# EasyEDA Pro project ProPrj_BEI Kimco Magnetic Cylindrical Frameless Linear Voice Coil Actuator LA15-16-020A_2025-06-26.epro, board PCB1
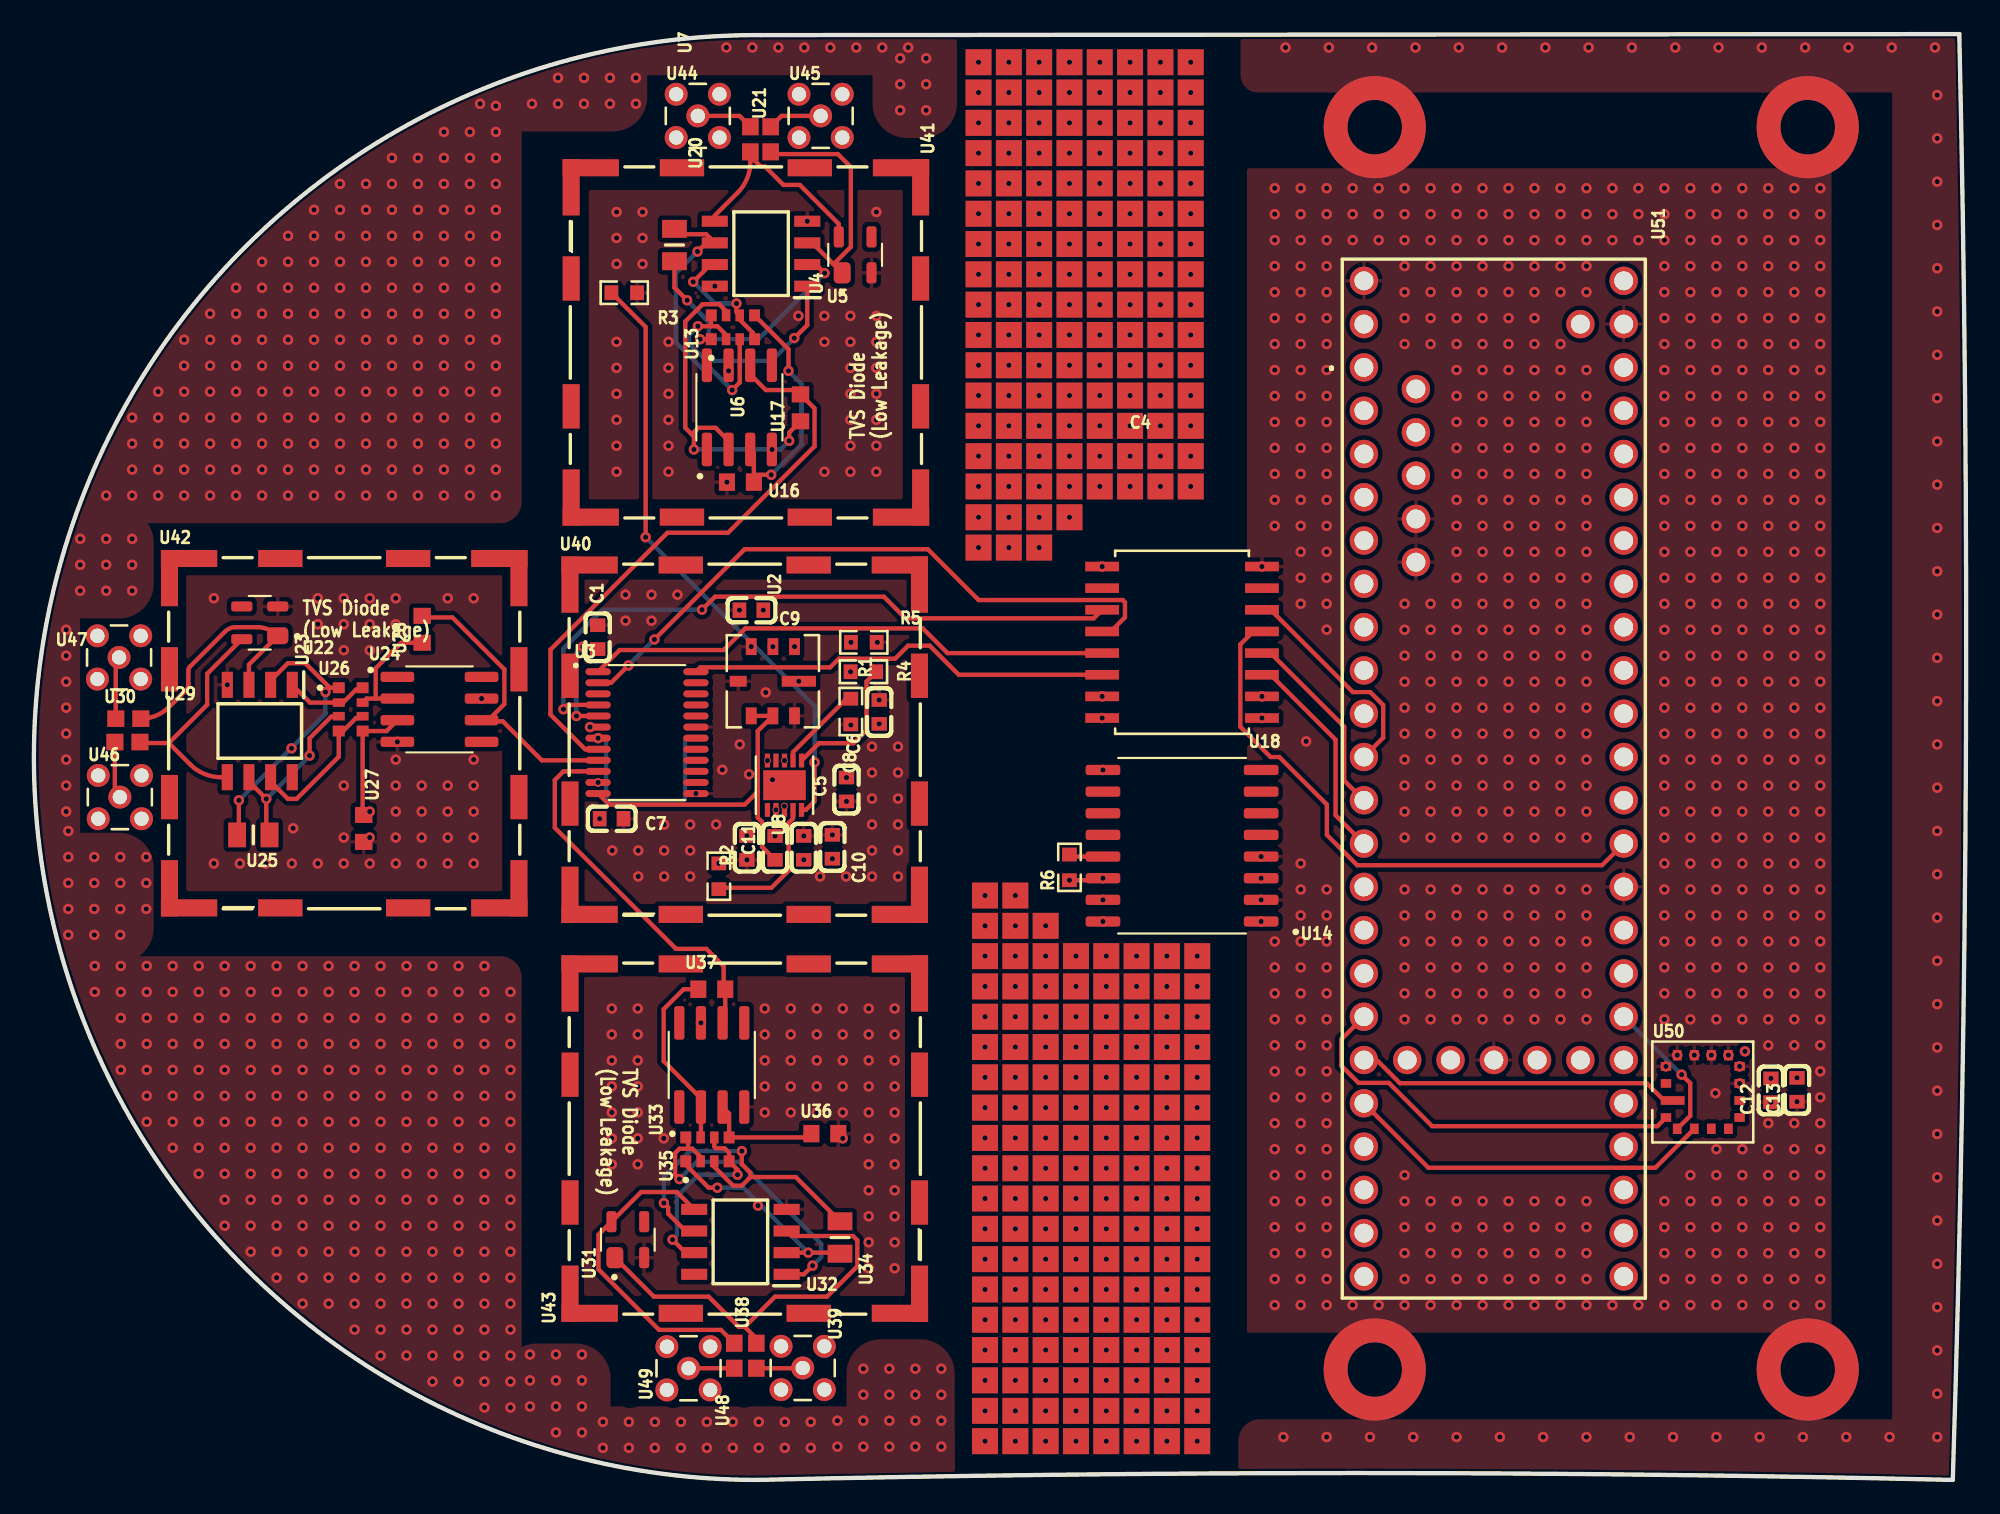
[diagram p1: board, top side]
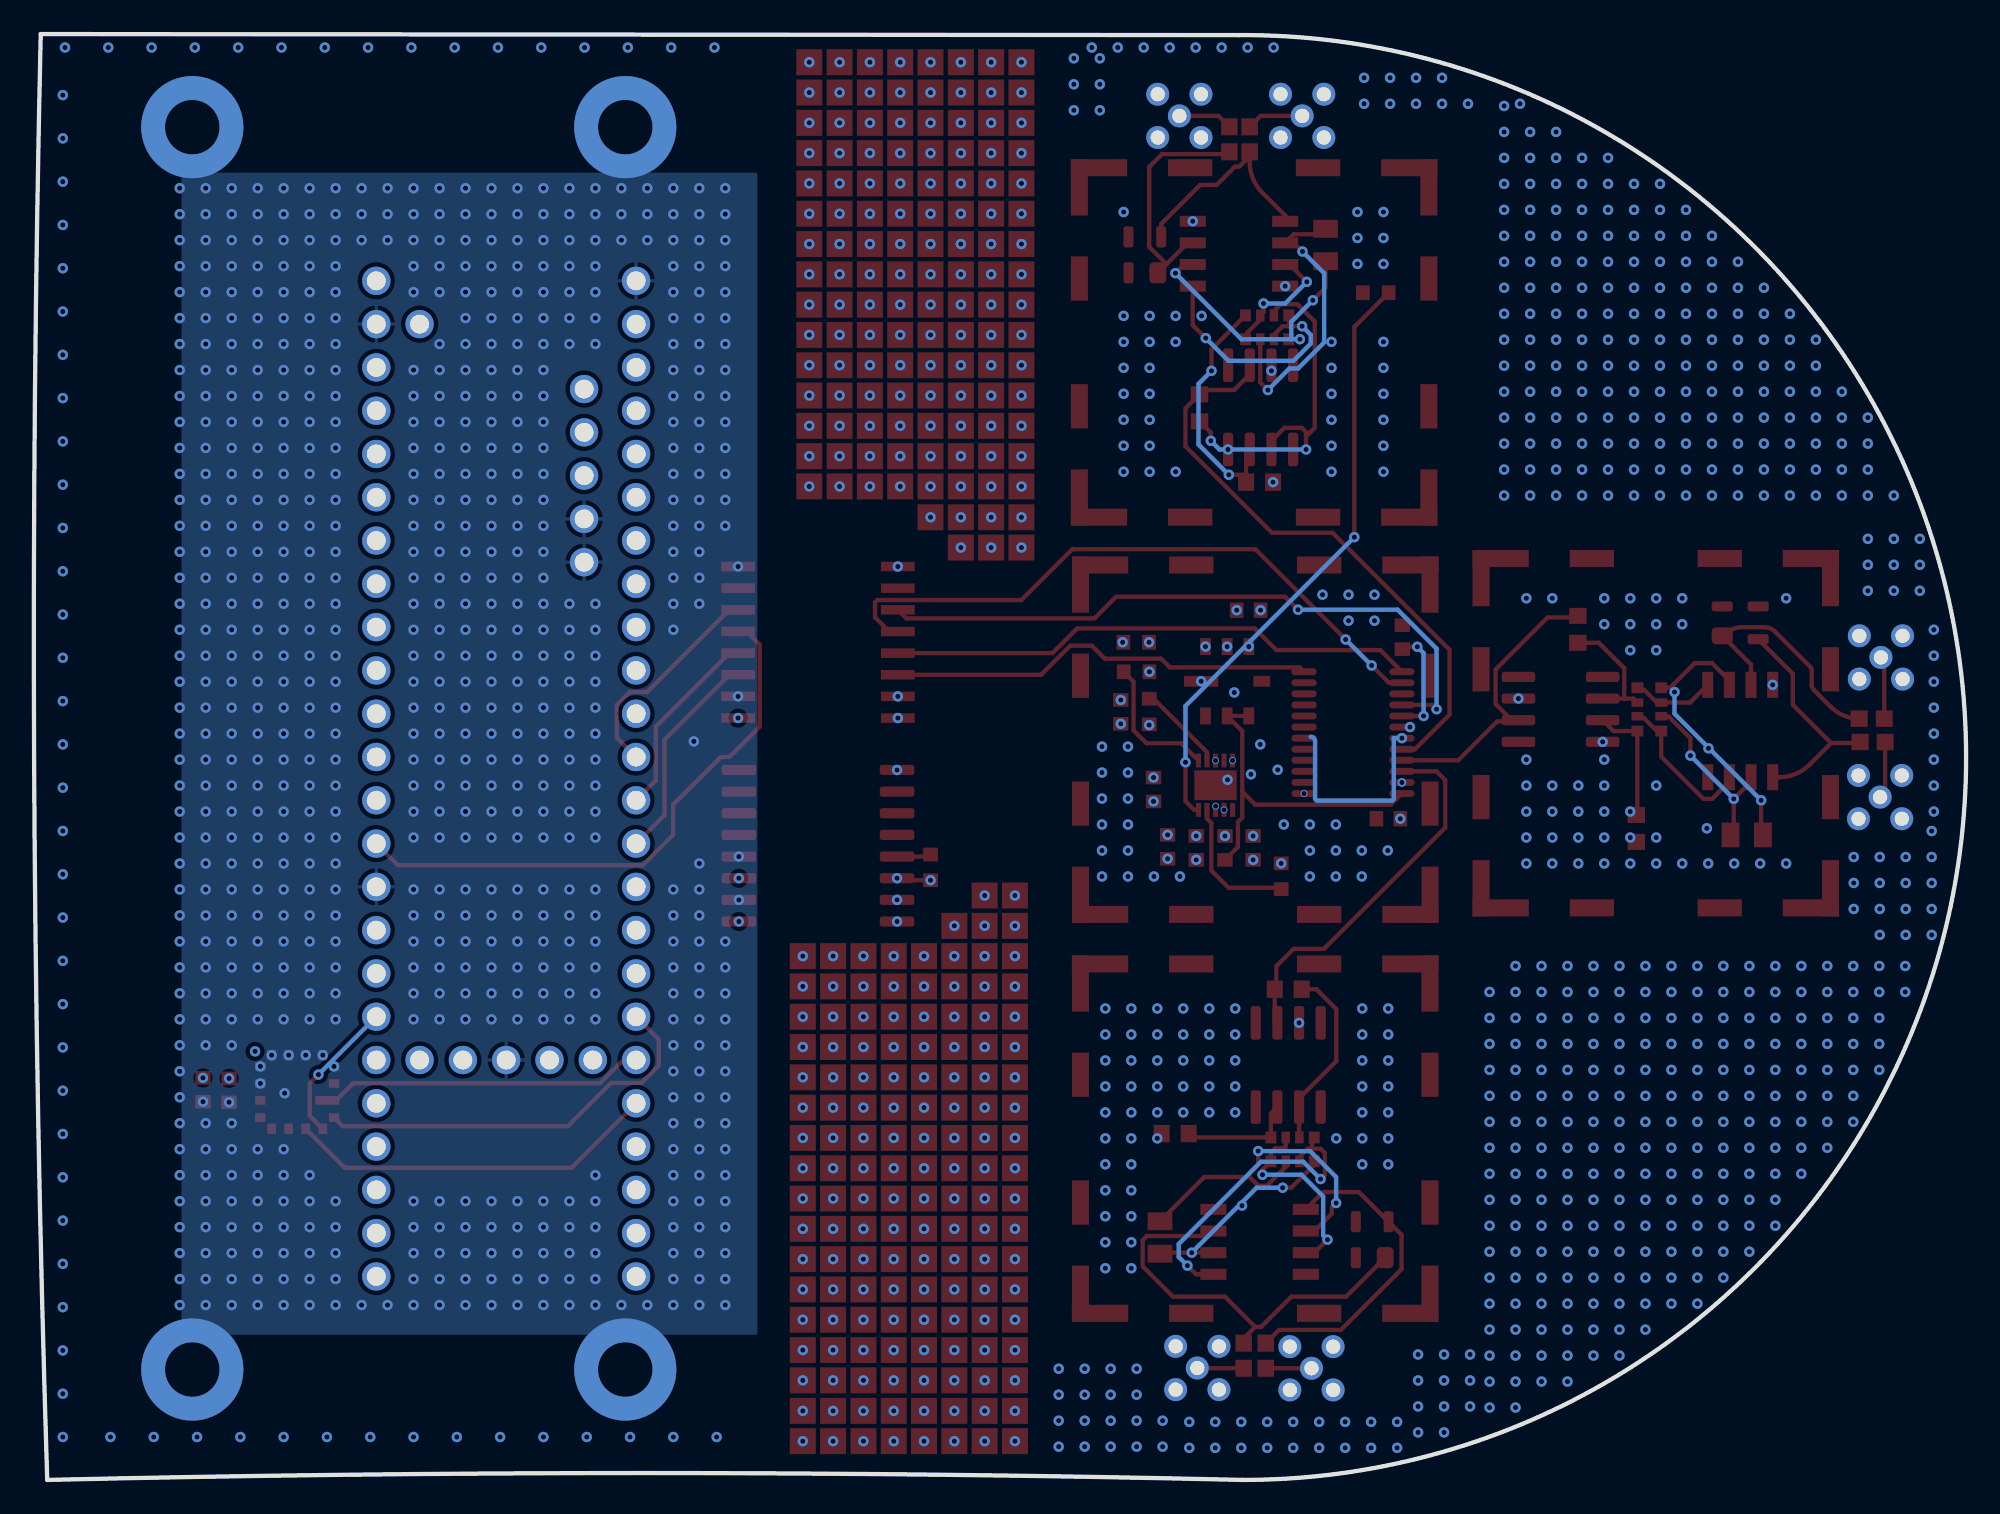
[diagram p2: board, bottom side, seen from below]

Outline 113.32 x 84.84 mm; copper layers: Top Layer, Inner1, Inner2, Bottom Layer. Coordinates in mm from the lower left corner of the outline.
Outline path: 42.45,0 arc(0,42.49) 42.64,84.78 112.93,84.84 arc(113.32,42.42) 112.55,0 arc(77.5,0.4) 42.45,0
Stack: Top Layer 0.035mm Outer layer thickness 1oz / Dielectric1 0.2104mm 7628 RC49% 8.6mil / Inner1 0.0152mm Inner layer thickness / Dielectric2 1.065mm 1.1mm H/HOZ Copper / Inner2 0.0152mm Inner layer thickness / Dielectric3 0.2104mm 7628 RC49% 8.6mil / Bottom Layer 0.035mm Outer layer thickness 1oz

## Design rules (mm)
template: Custom Config
spacing copperThickness1oz (default): track to track 0.102, other pairs 0.152 to 0.3
spacing copperThickness2oz: track to track 0.203, other pairs 0.152 to 0.3
track width copperThickness1oz (default): min 0.127, default 0.254, max 2.54
track width copperThickness2oz: min 0.203, default 0.254, max 2.54
differential pair differentialPair (default): width min 0.127, default 0.254, max 2.54; gap min 0.152, default 0.152
via viaSize (default): diameter min 0.5, default 0.61, max 10; hole min 0.3, default 0.305, max 6.3

## Placement (name value [footprint] x y rotation side)
C1  100nF  [C0603]  33.06 49.45 90 top
C4  10nF  [C0603]  49.58 45.06 90 top
C5  10uF  [C0603]  43.46 37.08 270 top
C6  100nF  [C0603]  47.66 40.51 90 top
C7  4.7uF  [C0603]  33.88 38.8 180 top
C8  4.7uF  [C0603]  45.15 37.09 270 top
C9  10nF  [C0603]  42.08 51.04 180 top
C10  10uF  [C0603]  46.83 37.15 90 top
C11  100nF  [C0603]  41.81 37.08 270 top
C12  100nF  [C0603]  101.88 22.86 90 top
C13  10uF  [C0603]  103.42 22.89 90 top
NOREF  -  [Pad_e42333]  58.96 67.18 0 top
NOREF#2  -  [Pad_e42535]  57.56 18.29 0 top
NOREF#3  -  [Pad_e42261]  66.07 76.07 0 top
NOREF#4  -  [Pad_e42613]  64.67 16.51 0 top
NOREF#5  -  [Pad_e42705]  57.56 34.29 0 top
NOREF#6  -  [Pad_e42433]  57.18 54.71 0 top
NOREF#7  -  [Pad_e42237]  58.96 77.85 0 top
NOREF#8  -  [Pad_e42533]  57.56 21.84 0 top
NOREF#9  -  [Pad_e42375]  67.85 63.63 0 top
NOREF#10  -  [Pad_e42649]  57.56 9.4 0 top
NOREF#11  -  [Pad_e42581]  68.23 12.95 0 top
NOREF#12  -  [Pad_e42213]  66.07 81.41 0 top
NOREF#13  -  [Pad_e42545]  59.34 28.96 0 top
NOREF#14  -  [Pad_e122]  55.78 4.05 0 top
NOREF#15  -  [Pad_e42661]  64.67 5.84 0 top
NOREF#16  -  [Pad_e42560]  64.67 25.4 0 top
NOREF#17  -  [Pad_e42359]  67.85 65.41 0 top
NOREF#18  -  [Pad_e42432]  57.18 56.48 0 top
NOREF#19  -  [Pad_e42567]  66.45 21.84 0 top
NOREF#20  -  [Pad_e42357]  66.07 65.41 0 top
NOREF#21  -  [Pad_e42566]  68.23 23.62 0 top
NOREF#22  -  [Pad_e42415]  60.74 58.29 0 top
NOREF#23  -  [Pad_e42574]  66.45 14.73 0 top
NOREF#24  -  [Pad_e42417]  62.51 58.29 0 top
NOREF#25  -  [Pad_e42594]  61.12 23.62 0 top
NOREF#26  -  [Pad_e42217]  55.4 79.63 0 top
NOREF#27  -  [Pad_e42612]  62.9 16.51 0 top
NOREF#28  -  [Pad_e42651]  57.56 5.84 0 top
NOREF#29  -  [Pad_e42365]  58.96 63.63 0 top
NOREF#30  -  [Pad_e42367]  60.74 63.63 0 top
NOREF#31  -  [Pad_e42369]  62.51 63.63 0 top
NOREF#32  -  [Pad_e42583]  55.78 28.96 0 top
NOREF#33  -  [Pad_e42537]  57.56 14.73 0 top
NOREF#34  -  [Pad_e42351]  60.74 65.41 0 top
NOREF#35  -  [Pad_e140]  62.9 2.27 0 top
NOREF#36  -  [Pad_e42573]  64.67 14.73 0 top
NOREF#37  -  [Pad_e42648]  57.56 11.18 0 top
NOREF#38  -  [Pad_e42311]  67.85 70.74 0 top
NOREF#39  -  [Pad_e42542]  62.9 30.73 0 top
NOREF#40  -  [Pad_e42203]  57.18 81.41 0 top
NOREF#41  -  [Pad_e42305]  62.51 70.74 0 top
NOREF#42  -  [Pad_e42271]  60.74 74.3 0 top
NOREF#43  -  [Pad_e42603]  66.45 20.07 0 top
NOREF#44  -  [Pad_e42371]  64.29 63.63 0 top
NOREF#45  -  [Pad_e42419]  64.29 58.29 0 top
NOREF#46  -  [Pad_e42231]  67.85 79.63 0 top
NOREF#47  -  [Pad_e42353]  62.51 65.41 0 top
NOREF#48  -  [Pad_e42243]  64.29 77.85 0 top
NOREF#49  -  [Pad_e42197]  66.07 83.19 0 top
NOREF#50  -  [Pad_e42615]  68.23 16.51 0 top
NOREF#51  -  [Pad_e42609]  68.23 18.29 0 top
NOREF#52  -  [Pad_e42295]  67.85 72.52 0 top
NOREF#53  -  [Pad_e42387]  64.29 61.85 0 top
NOREF#54  -  [Pad_e42611]  61.12 16.51 0 top
NOREF#55  -  [Pad_e42563]  62.9 23.62 0 top
NOREF#56  -  [Pad_e132]  59.34 4.05 0 top
NOREF#57  -  [Pad_e42580]  66.45 12.95 0 top
NOREF#58  -  [Pad_e42677]  55.78 9.4 0 top
NOREF#59  -  [Pad_e133]  59.34 2.27 0 top
NOREF#60  -  [Pad_e42325]  66.07 68.96 0 top
NOREF#61  -  [Pad_e42307]  64.29 70.74 0 top
NOREF#62  -  [Pad_e42397]  58.96 60.07 0 top
NOREF#63  -  [Pad_e42561]  66.45 25.4 0 top
NOREF#64  -  [Pad_e42701]  59.34 32.51 0 top
NOREF#65  -  [Pad_e42602]  64.67 20.07 0 top
NOREF#66  -  [Pad_e42187]  57.18 83.19 0 top
NOREF#67  -  [Pad_e42674]  66.45 9.4 0 top
NOREF#68  -  [Pad_e42395]  57.18 60.07 0 top
NOREF#69  -  [Pad_e42205]  58.96 81.41 0 top
NOREF#70  -  [Pad_e42257]  62.51 76.07 0 top
NOREF#71  -  [Pad_e42588]  55.78 20.07 0 top
NOREF#72  -  [Pad_e42653]  61.12 7.62 0 top
NOREF#73  -  [Pad_e42403]  64.29 60.07 0 top
NOREF#74  -  [Pad_e42297]  55.4 70.74 0 top
NOREF#75  -  [Pad_e42546]  61.12 28.96 0 top
NOREF#76  -  [Pad_e42289]  62.51 72.52 0 top
NOREF#77  -  [Pad_e42552]  61.12 27.18 0 top
NOREF#78  -  [Pad_e42582]  55.78 30.73 0 top
NOREF#79  -  [Pad_e42664]  59.34 11.18 0 top
NOREF#80  -  [Pad_e42606]  62.9 18.29 0 top
NOREF#81  -  [Pad_e42554]  64.67 27.18 0 top
NOREF#82  -  [Pad_e42544]  66.45 30.73 0 top
NOREF#83  -  [Pad_e135]  61.12 4.05 0 top
NOREF#84  -  [Pad_e42678]  55.78 7.62 0 top
NOREF#85  -  [Pad_e42667]  64.67 11.18 0 top
NOREF#86  -  [Pad_e42568]  68.23 21.84 0 top
NOREF#87  -  [Pad_e42584]  55.78 27.18 0 top
NOREF#88  -  [Pad_e42313]  55.4 68.96 0 top
NOREF#89  -  [Pad_e42551]  59.34 27.18 0 top
NOREF#90  -  [Pad_e42329]  55.4 67.18 0 top
NOREF#91  -  [Pad_e42655]  64.67 7.62 0 top
NOREF#92  -  [Pad_e137]  61.12 2.27 0 top
NOREF#93  -  [Pad_e42379]  57.18 61.85 0 top
NOREF#94  -  [Pad_e42605]  61.12 18.29 0 top
NOREF#95  -  [Pad_e42549]  66.45 28.96 0 top
NOREF#96  -  [Pad_e42215]  67.85 81.41 0 top
NOREF#97  -  [Pad_e42347]  57.18 65.41 0 top
NOREF#98  -  [Pad_e42421]  66.07 58.29 0 top
NOREF#99  -  [Pad_e42223]  60.74 79.63 0 top
NOREF#100  -  [Pad_e42663]  68.23 5.84 0 top
NOREF#101  -  [Pad_e42343]  67.85 67.18 0 top
NOREF#102  -  [Pad_e42586]  55.78 23.62 0 top
NOREF#103  -  [Pad_e42596]  61.12 21.84 0 top
NOREF#104  -  [Pad_e42273]  62.51 74.3 0 top
NOREF#105  -  [Pad_e42199]  67.85 83.19 0 top
NOREF#106  -  [Pad_e42321]  62.51 68.96 0 top
NOREF#107  -  [Pad_e42229]  66.07 79.63 0 top
NOREF#108  -  [Pad_e42401]  62.51 60.07 0 top
NOREF#109  -  [Pad_e42279]  67.85 74.3 0 top
NOREF#110  -  [Pad_e123]  57.56 2.27 0 top
NOREF#111  -  [Pad_e131]  57.56 4.05 0 top
NOREF#112  -  [Pad_e42281]  55.4 72.52 0 top
NOREF#113  -  [Pad_e42283]  57.18 72.52 0 top
NOREF#114  -  [Pad_e42671]  61.12 9.4 0 top
NOREF#115  -  [Pad_e42676]  55.78 11.18 0 top
NOREF#116  -  [Pad_e42536]  57.56 16.51 0 top
NOREF#117  -  [Pad_e42543]  64.67 30.73 0 top
NOREF#118  -  [Pad_e42575]  68.23 14.73 0 top
NOREF#119  -  [Pad_e42601]  62.9 20.07 0 top
NOREF#120  -  [Pad_e42585]  55.78 25.4 0 top
NOREF#121  -  [Pad_e42436]  58.96 54.71 0 top
NOREF#122  -  [Pad_e42439]  60.74 56.48 0 top
NOREF#123  -  [Pad_e42538]  57.56 12.95 0 top
NOREF#124  -  [Pad_e42277]  66.07 74.3 0 top
NOREF#125  -  [Pad_e42565]  66.45 23.62 0 top
NOREF#126  -  [Pad_e42571]  61.12 14.73 0 top
NOREF#127  -  [Pad_e42540]  59.34 30.73 0 top
NOREF#128  -  [Pad_e42541]  61.12 30.73 0 top
NOREF#129  -  [Pad_e42530]  57.56 27.18 0 top
NOREF#130  -  [Pad_e42652]  59.34 7.62 0 top
NOREF#131  -  [Pad_e42599]  59.34 20.07 0 top
NOREF#132  -  [Pad_e42656]  66.45 7.62 0 top
NOREF#133  -  [Pad_e42665]  61.12 11.18 0 top
NOREF#134  -  [Pad_e42393]  55.4 60.07 0 top
NOREF#135  -  [Pad_e42658]  59.34 5.84 0 top
NOREF#136  -  [Pad_e42209]  62.51 81.41 0 top
NOREF#137  -  [Pad_e42355]  64.29 65.41 0 top
NOREF#138  -  [Pad_e42193]  62.51 83.19 0 top
NOREF#139  -  [Pad_e42377]  55.4 61.85 0 top
NOREF#140  -  [Pad_e42435]  55.4 54.71 0 top
NOREF#141  -  [Pad_e149]  68.23 2.27 0 top
NOREF#142  -  [Pad_e42572]  62.9 14.73 0 top
NOREF#143  -  [Pad_e42534]  57.56 20.07 0 top
NOREF#144  -  [Pad_e42267]  57.18 74.3 0 top
NOREF#145  -  [Pad_e42610]  59.34 16.51 0 top
NOREF#146  -  [Pad_e42570]  59.34 14.73 0 top
NOREF#147  -  [Pad_e121]  55.78 2.27 0 top
NOREF#148  -  [Pad_e42434]  55.4 56.48 0 top
NOREF#149  -  [Pad_e42679]  55.78 5.84 0 top
NOREF#150  -  [Pad_e42245]  66.07 77.85 0 top
NOREF#151  -  [Pad_e42650]  57.56 7.62 0 top
NOREF#152  -  [Pad_e42363]  57.18 63.63 0 top
NOREF#153  -  [Pad_e42317]  58.96 68.96 0 top
NOREF#154  -  [Pad_e42381]  58.96 61.85 0 top
NOREF#155  -  [Pad_e42559]  62.9 25.4 0 top
NOREF#156  -  [Pad_e42201]  55.4 81.41 0 top
NOREF#157  -  [Pad_e42269]  58.96 74.3 0 top
NOREF#158  -  [Pad_e42608]  66.45 18.29 0 top
NOREF#159  -  [Pad_e42539]  68.23 30.73 0 top
NOREF#160  -  [Pad_e42293]  66.07 72.52 0 top
NOREF#161  -  [Pad_e42614]  66.45 16.51 0 top
NOREF#162  -  [Pad_e42576]  59.34 12.95 0 top
NOREF#163  -  [Pad_e42532]  57.56 23.62 0 top
NOREF#164  -  [Pad_e42373]  66.07 63.63 0 top
NOREF#165  -  [Pad_e42666]  62.9 11.18 0 top
NOREF#166  -  [Pad_e42528]  57.56 30.73 0 top
NOREF#167  -  [Pad_e42253]  58.96 76.07 0 top
NOREF#168  -  [Pad_e42438]  58.96 56.48 0 top
NOREF#169  -  [Pad_e42301]  58.96 70.74 0 top
NOREF#170  -  [Pad_e42557]  59.34 25.4 0 top
NOREF#171  -  [Pad_e42255]  60.74 76.07 0 top
NOREF#172  -  [Pad_e42287]  60.74 72.52 0 top
NOREF#173  -  [Pad_e42345]  55.4 65.41 0 top
NOREF#174  -  [Pad_e42389]  66.07 61.85 0 top
NOREF#175  -  [Pad_e42672]  62.9 9.4 0 top
NOREF#176  -  [Pad_e42259]  64.29 76.07 0 top
NOREF#177  -  [Pad_e42399]  60.74 60.07 0 top
NOREF#178  -  [Pad_e42361]  55.4 63.63 0 top
NOREF#179  -  [Pad_e42604]  59.34 18.29 0 top
NOREF#180  -  [Pad_e42409]  55.4 58.29 0 top
NOREF#181  -  [Pad_e42227]  64.29 79.63 0 top
NOREF#182  -  [Pad_e42195]  64.29 83.19 0 top
NOREF#183  -  [Pad_e42225]  62.51 79.63 0 top
NOREF#184  -  [Pad_e42337]  62.51 67.18 0 top
NOREF#185  -  [Pad_e42577]  61.12 12.95 0 top
NOREF#186  -  [Pad_e42550]  68.23 28.96 0 top
NOREF#187  -  [Pad_e42598]  64.67 21.84 0 top
NOREF#188  -  [Pad_e42383]  60.74 61.85 0 top
NOREF#189  -  [Pad_e42411]  57.18 58.29 0 top
NOREF#190  -  [Pad_e42600]  61.12 20.07 0 top
NOREF#191  -  [Pad_e42405]  66.07 60.07 0 top
NOREF#192  -  [Pad_e42303]  60.74 70.74 0 top
NOREF#193  -  [Pad_e42249]  55.4 76.07 0 top
NOREF#194  -  [Pad_e7981]  55.4 83.19 0 top
NOREF#195  -  [Pad_e42285]  58.96 72.52 0 top
NOREF#196  -  [Pad_e42327]  67.85 68.96 0 top
NOREF#197  -  [Pad_e42589]  55.78 18.29 0 top
NOREF#198  -  [Pad_e42700]  57.56 32.51 0 top
NOREF#199  -  [Pad_e42675]  68.23 9.4 0 top
NOREF#200  -  [Pad_e42564]  64.67 23.62 0 top
NOREF#201  -  [Pad_e42668]  66.45 11.18 0 top
NOREF#202  -  [Pad_e42423]  67.85 58.29 0 top
NOREF#203  -  [Pad_e42241]  62.51 77.85 0 top
NOREF#204  -  [Pad_e138]  62.9 4.05 0 top
NOREF#205  -  [Pad_e42660]  62.9 5.84 0 top
NOREF#206  -  [Pad_e42673]  64.67 9.4 0 top
NOREF#207  -  [Pad_e42548]  64.67 28.96 0 top
NOREF#208  -  [Pad_e42219]  57.18 79.63 0 top
NOREF#209  -  [Pad_e42235]  57.18 77.85 0 top
NOREF#210  -  [Pad_e42319]  60.74 68.96 0 top
NOREF#211  -  [Pad_e144]  66.45 2.27 0 top
NOREF#212  -  [Pad_e42553]  62.9 27.18 0 top
NOREF#213  -  [Pad_e42275]  64.29 74.3 0 top
NOREF#214  -  [Pad_e42207]  60.74 81.41 0 top
NOREF#215  -  [Pad_e42531]  57.56 25.4 0 top
NOREF#216  -  [Pad_e42323]  64.29 68.96 0 top
NOREF#217  -  [Pad_e42221]  58.96 79.63 0 top
NOREF#218  -  [Pad_e141]  64.67 4.05 0 top
NOREF#219  -  [Pad_e42189]  58.96 83.19 0 top
NOREF#220  -  [Pad_e42335]  60.74 67.18 0 top
NOREF#221  -  [Pad_e42592]  55.78 12.95 0 top
NOREF#222  -  [Pad_e42211]  64.29 81.41 0 top
NOREF#223  -  [Pad_e42555]  66.45 27.18 0 top
NOREF#224  -  [Pad_e142]  64.67 2.27 0 top
NOREF#225  -  [Pad_e42529]  57.56 28.96 0 top
NOREF#226  -  [Pad_e42349]  58.96 65.41 0 top
NOREF#227  -  [Pad_e42385]  62.51 61.85 0 top
NOREF#228  -  [Pad_e42407]  67.85 60.07 0 top
NOREF#229  -  [Pad_e42706]  55.78 34.29 0 top
NOREF#230  -  [Pad_e42233]  55.4 77.85 0 top
NOREF#231  -  [Pad_e42562]  68.23 25.4 0 top
NOREF#232  -  [Pad_e42239]  60.74 77.85 0 top
NOREF#233  -  [Pad_e42569]  68.23 20.07 0 top
NOREF#234  -  [Pad_e42251]  57.18 76.07 0 top
NOREF#235  -  [Pad_e42191]  60.74 83.19 0 top
NOREF#236  -  [Pad_e42578]  62.9 12.95 0 top
NOREF#237  -  [Pad_e42247]  67.85 77.85 0 top
NOREF#238  -  [Pad_e42547]  62.9 28.96 0 top
NOREF#239  -  [Pad_e42597]  62.9 21.84 0 top
NOREF#240  -  [Pad_e42413]  58.96 58.29 0 top
NOREF#241  -  [Pad_e42654]  62.9 7.62 0 top
NOREF#242  -  [Pad_e42341]  66.07 67.18 0 top
NOREF#243  -  [Pad_e147]  68.23 4.05 0 top
NOREF#244  -  [Pad_e42315]  57.18 68.96 0 top
NOREF#245  -  [Pad_e42702]  55.78 32.51 0 top
NOREF#246  -  [Pad_e42556]  68.23 27.18 0 top
NOREF#247  -  [Pad_e42579]  64.67 12.95 0 top
NOREF#248  -  [Pad_e42263]  67.85 76.07 0 top
NOREF#249  -  [Pad_e42595]  59.34 21.84 0 top
NOREF#250  -  [Pad_e42558]  61.12 25.4 0 top
NOREF#251  -  [Pad_e42670]  59.34 9.4 0 top
NOREF#252  -  [Pad_e145]  66.45 4.05 0 top
NOREF#253  -  [Pad_e42591]  55.78 14.73 0 top
NOREF#254  -  [Pad_e42391]  67.85 61.85 0 top
NOREF#255  -  [Pad_e42590]  55.78 16.51 0 top
NOREF#256  -  [Pad_e42662]  66.45 5.84 0 top
NOREF#257  -  [Pad_e42309]  66.07 70.74 0 top
NOREF#258  -  [Pad_e42339]  64.29 67.18 0 top
NOREF#259  -  [Pad_e42607]  64.67 18.29 0 top
NOREF#260  -  [Pad_e42669]  68.23 11.18 0 top
NOREF#261  -  [Pad_e42291]  64.29 72.52 0 top
NOREF#262  -  [Pad_e42659]  61.12 5.84 0 top
NOREF#263  -  [Pad_e42331]  57.18 67.18 0 top
NOREF#264  -  [Pad_e42299]  57.18 70.74 0 top
NOREF#265  -  [Pad_e42593]  59.34 23.62 0 top
NOREF#266  -  [Pad_e42657]  68.23 7.62 0 top
NOREF#267  -  [Pad_e42265]  55.4 74.3 0 top
NOREF#268  -  [Pad_e42587]  55.78 21.84 0 top
R1  10K  [R0603]  47.91 45.09 270 top
R2  200K  [R0603]  40.17 35.42 270 top
R3  499  [R0603]  34.62 69.66 180 top
R4  49.9K±1%  [R0603]  48.65 47.42 180 top
R5  453K±1%  [R0603]  48.67 49.15 0 top
R6  10K  [R0603]  60.74 35.94 90 top
U2  ltc6655chls8-2.5-pbf  [LTC6655CHLS8-2.5-PBF]  43.34 46.86 270 top
U3  AD7124-4BRUZ-RL  [SOP65P640X120-24N]  35.95 43.85 0 top
U4  TPD2E001DZDR  [SOT192P237X122-4N]  48.16 71.88 90 top
U5  OPA2189ID  [SOIC127P600X175-8N]  42.64 71.95 180 top
U6  OPA189ID  [SOIC127P599X175-8N]  41.37 62.93 90 top
U7  RG2012P-222-B-T5  [RESC2012X50N]  37.56 72.46 270 top
U8  LT3042HDD#TRPBF  [DFN-10_DD]  44.02 40.76 90 top
U13  ACASA1002S1002P1AT  [RESCAXS80P320X150X55-8N]  40.99 67.63 90 top
U14  R05CT05S-R  [SOIC127P1030X265-16N]  67.34 37.21 180 top
U16  RG1608P-103-B-T5  [RESC1608X50N]  41.43 58.55 180 top
U17  RG1608P-103-B-T5  [RESC1608X50N]  44.96 62.91 90 top
U18  adum140e1brwz  [ADUM140E1BRWZ]  67.34 49.15 180 top
U20  BLM18EG101TN1D  [BEADC1608X65N]  42.02 78.66 90 top
U21  BLM18EG101TN1D  [BEADC1608X65N]  43.21 78.66 270 top
U22  TPD2E001DZDR  [SOT192P237X122-4N]  13.24 50.29 180 top
U23  OPA2189ID  [SOIC127P600X175-8N]  13.24 43.94 270 top
U24  OPA189ID  [SOIC127P599X175-8N]  23.78 45.21 0 top
U25  RG2012P-222-B-T5  [RESC2012X50N]  12.86 37.85 180 top
U26  ACASA1002S1002P1AT  [RESCAXS80P320X150X55-8N]  18.57 45.21 0 top
U27  RG1608P-103-B-T5  [RESC1608X50N]  19.33 38.23 270 top
U28  RG1608P-103-B-T5  [RESC1608X50N]  22.76 49.91 90 top
U29  BLM18EG101TN1D  [BEADC1608X65N]  5.47 43.3 180 top
U30  BLM18EG101TN1D  [BEADC1608X65N]  5.53 44.67 0 top
U31  TPD2E001DZDR  [SOT192P237X122-4N]  34.83 14.1 90 top
U32  OPA2189ID  [SOIC127P600X175-8N]  41.43 13.97 180 top
U33  OPA189ID  [SOIC127P599X175-8N]  39.75 24.35 90 top
U34  RG2012P-222-B-T5  [RESC2012X50N]  47.27 14.22 270 top
U35  ACASA1002S1002P1AT  [RESCAXS80P320X150X55-8N]  39.5 19.4 90 top
U36  RG1608P-103-B-T5  [RESC1608X50N]  46.39 20.32 0 top
U37  RG1608P-103-B-T5  [RESC1608X50N]  39.75 28.79 0 top
U38  BLM18EG101TN1D  [BEADC1608X65N]  41.07 7.29 270 top
U39  BLM18EG101TN1D  [BEADC1608X65N]  42.37 7.29 90 top
U40  WE-SHC_SMD-FRAME__36103205S  [WE-SHC_SMD-FRAME_36103205S]  41.69 43.43 0 top
U41  WE-SHC_SMD-FRAME__36103205S  [WE-SHC_SMD-FRAME_36103205S]  41.75 66.74 270 top
U42  WE-SHC_SMD-FRAME__36103205S  [WE-SHC_SMD-FRAME_36103205S]  18.19 43.82 0 top
U43  WE-SHC_SMD-FRAME__36103205S  [WE-SHC_SMD-FRAME_36103205S]  41.69 20.03 90 top
U44  734151471  [CONN_734151471_MOL]  38.93 80.04 0 top
U45  734151471  [CONN_734151471_MOL]  46.14 80.04 0 top
U46  734151471  [CONN_734151471_MOL]  5.03 40.07 0 top
U47  734151471  [CONN_734151471_MOL]  4.98 48.26 0 top
U48  734151471  [CONN_734151471_MOL]  45.09 6.57 90 top
U49  734151471  [CONN_734151471_MOL]  38.39 6.55 90 top
U50  lis3dhhtr  [LIS3DHHTR]  97.89 22.76 0 top
U51  TEENSY_4.1  [TEENSY41]  78.01 65.28 270 top

## Footprints (pads in the part's own frame, mm; a bottom-side part is the same pattern mirrored in y, then rotated)
ADUM140E1BRWZ
  rect 1.981x0.559 smd: 1(-4.686,4.445) 2(-4.686,3.175) 3(-4.686,1.905) 4(-4.686,0.635) 5(-4.686,-0.635) 6(-4.686,-1.905) 7(-4.686,-3.175) 8(-4.686,-4.445) 9(4.686,-4.445) 10(4.686,-3.175) 11(4.686,-1.905) 12(4.686,-0.635) 13(4.686,0.635) 14(4.686,1.905) 15(4.686,3.175) 16(4.686,4.445)
BEADC1608X65N
  rect 1x0.97 smd: 1(-0.735,0) 2(0.735,0)
C0603
  rect 0.8x0.9 smd: 1(-0.7,0) 2(0.7,0)
CONN_734151471_MOL
  round 1.346 hole 0.838: 1(0,0) 2(-1.27,1.27) 3(-1.27,-1.27) 4(1.27,-1.27) 5(1.27,1.27)
DFN-10_DD
  rect 0.813x0.305 smd: 1(-1.448,1) 2(-1.448,0.5) 3(-1.448,0) 4(-1.448,-0.5) 5(-1.448,-1) 6(1.448,-1) 7(1.448,-0.5) 8(1.448,0) 9(1.448,0.5) 10(1.448,1)
  rect 1.752x2.489 smd: 11(0,0)
LIS3DHHTR
  rect 1.397x0.508 smd: 1(-1.767,-0.5)
  rect 0.61x0.508 smd: 2(-2.16,-1.5) 7(2.16,-1.5) 8(2.16,-0.5) 9(2.16,0.5) 10(2.16,1.5) 15(-2.16,1.5) 16(-2.16,0.5)
  rect 0.508x0.61 smd: 3(-1.5,-2.16) 4(-0.5,-2.16) 5(0.5,-2.16) 6(1.5,-2.16) 11(1.5,2.16) 12(0.5,2.16) 13(-0.5,2.16) 14(-1.5,2.16)
LTC6655CHLS8-2.5-PBF
  rect 0.635x2.006 smd: 1(0,1.524)
  rect 0.991x0.635 smd: 2(-2.032,1.27) 3(-2.032,0) 4(-2.032,-1.27) 6(2.032,-1.27) 7(2.032,0) 8(2.032,1.27)
  rect 0.635x0.991 smd: 5(0,-2.032)
Pad_e121
  rect 1.524x1.524 smd: 130(0,0)
Pad_e122
  rect 1.524x1.524 smd: 122(0,0)
Pad_e123
  rect 1.524x1.524 smd: 131(0,0)
Pad_e131
  rect 1.524x1.524 smd: 123(0,0)
Pad_e132
  rect 1.524x1.524 smd: 124(0,0)
Pad_e133
  rect 1.524x1.524 smd: 132(0,0)
Pad_e135
  rect 1.524x1.524 smd: 125(0,0)
Pad_e137
  rect 1.524x1.524 smd: 133(0,0)
Pad_e138
  rect 1.524x1.524 smd: 126(0,0)
Pad_e140
  rect 1.524x1.524 smd: 134(0,0)
Pad_e141
  rect 1.524x1.524 smd: 127(0,0)
Pad_e142
  rect 1.524x1.524 smd: 135(0,0)
Pad_e144
  rect 1.524x1.524 smd: 136(0,0)
Pad_e145
  rect 1.524x1.524 smd: 128(0,0)
Pad_e147
  rect 1.524x1.524 smd: 129(0,0)
Pad_e149
  rect 1.524x1.524 smd: 137(0,0)
Pad_e7981
  rect 1.524x1.524 smd: 1(0,0)
Pad_e42187
  rect 1.524x1.524 smd: 2(0,0)
Pad_e42189
  rect 1.524x1.524 smd: 54(0,0)
Pad_e42191
  rect 1.524x1.524 smd: 56(0,0)
Pad_e42193
  rect 1.524x1.524 smd: 58(0,0)
Pad_e42195
  rect 1.524x1.524 smd: 59(0,0)
Pad_e42197
  rect 1.524x1.524 smd: 60(0,0)
Pad_e42199
  rect 1.524x1.524 smd: 61(0,0)
Pad_e42201
  rect 1.524x1.524 smd: 62(0,0)
Pad_e42203
  rect 1.524x1.524 smd: 63(0,0)
Pad_e42205
  rect 1.524x1.524 smd: 64(0,0)
Pad_e42207
  rect 1.524x1.524 smd: 65(0,0)
Pad_e42209
  rect 1.524x1.524 smd: 66(0,0)
Pad_e42211
  rect 1.524x1.524 smd: 67(0,0)
Pad_e42213
  rect 1.524x1.524 smd: 72(0,0)
Pad_e42215
  rect 1.524x1.524 smd: 73(0,0)
Pad_e42217
  rect 1.524x1.524 smd: 74(0,0)
Pad_e42219
  rect 1.524x1.524 smd: 75(0,0)
Pad_e42221
  rect 1.524x1.524 smd: 76(0,0)
Pad_e42223
  rect 1.524x1.524 smd: 77(0,0)
Pad_e42225
  rect 1.524x1.524 smd: 78(0,0)
Pad_e42227
  rect 1.524x1.524 smd: 79(0,0)
Pad_e42229
  rect 1.524x1.524 smd: 80(0,0)
Pad_e42231
  rect 1.524x1.524 smd: 81(0,0)
Pad_e42233
  rect 1.524x1.524 smd: 82(0,0)
Pad_e42235
  rect 1.524x1.524 smd: 83(0,0)
Pad_e42237
  rect 1.524x1.524 smd: 84(0,0)
Pad_e42239
  rect 1.524x1.524 smd: 85(0,0)
Pad_e42241
  rect 1.524x1.524 smd: 86(0,0)
Pad_e42243
  rect 1.524x1.524 smd: 87(0,0)
Pad_e42245
  rect 1.524x1.524 smd: 88(0,0)
Pad_e42247
  rect 1.524x1.524 smd: 89(0,0)
Pad_e42249
  rect 1.524x1.524 smd: 90(0,0)
Pad_e42251
  rect 1.524x1.524 smd: 91(0,0)
Pad_e42253
  rect 1.524x1.524 smd: 92(0,0)
Pad_e42255
  rect 1.524x1.524 smd: 93(0,0)
Pad_e42257
  rect 1.524x1.524 smd: 94(0,0)
Pad_e42259
  rect 1.524x1.524 smd: 95(0,0)
Pad_e42261
  rect 1.524x1.524 smd: 96(0,0)
Pad_e42263
  rect 1.524x1.524 smd: 97(0,0)
Pad_e42265
  rect 1.524x1.524 smd: 98(0,0)
Pad_e42267
  rect 1.524x1.524 smd: 99(0,0)
Pad_e42269
  rect 1.524x1.524 smd: 100(0,0)
Pad_e42271
  rect 1.524x1.524 smd: 101(0,0)
Pad_e42273
  rect 1.524x1.524 smd: 102(0,0)
Pad_e42275
  rect 1.524x1.524 smd: 103(0,0)
Pad_e42277
  rect 1.524x1.524 smd: 104(0,0)
Pad_e42279
  rect 1.524x1.524 smd: 105(0,0)
Pad_e42281
  rect 1.524x1.524 smd: 106(0,0)
Pad_e42283
  rect 1.524x1.524 smd: 107(0,0)
Pad_e42285
  rect 1.524x1.524 smd: 108(0,0)
Pad_e42287
  rect 1.524x1.524 smd: 109(0,0)
Pad_e42289
  rect 1.524x1.524 smd: 110(0,0)
Pad_e42291
  rect 1.524x1.524 smd: 111(0,0)
Pad_e42293
  rect 1.524x1.524 smd: 112(0,0)
Pad_e42295
  rect 1.524x1.524 smd: 113(0,0)
Pad_e42297
  rect 1.524x1.524 smd: 114(0,0)
Pad_e42299
  rect 1.524x1.524 smd: 115(0,0)
Pad_e42301
  rect 1.524x1.524 smd: 116(0,0)
Pad_e42303
  rect 1.524x1.524 smd: 117(0,0)
Pad_e42305
  rect 1.524x1.524 smd: 118(0,0)
Pad_e42307
  rect 1.524x1.524 smd: 119(0,0)
Pad_e42309
  rect 1.524x1.524 smd: 120(0,0)
Pad_e42311
  rect 1.524x1.524 smd: 121(0,0)
Pad_e42313
  rect 1.524x1.524 smd: 122(0,0)
Pad_e42315
  rect 1.524x1.524 smd: 123(0,0)
Pad_e42317
  rect 1.524x1.524 smd: 124(0,0)
Pad_e42319
  rect 1.524x1.524 smd: 125(0,0)
Pad_e42321
  rect 1.524x1.524 smd: 126(0,0)
Pad_e42323
  rect 1.524x1.524 smd: 127(0,0)
Pad_e42325
  rect 1.524x1.524 smd: 128(0,0)
Pad_e42327
  rect 1.524x1.524 smd: 129(0,0)
Pad_e42329
  rect 1.524x1.524 smd: 130(0,0)
Pad_e42331
  rect 1.524x1.524 smd: 131(0,0)
Pad_e42333
  rect 1.524x1.524 smd: 132(0,0)
Pad_e42335
  rect 1.524x1.524 smd: 133(0,0)
Pad_e42337
  rect 1.524x1.524 smd: 134(0,0)
Pad_e42339
  rect 1.524x1.524 smd: 135(0,0)
Pad_e42341
  rect 1.524x1.524 smd: 136(0,0)
Pad_e42343
  rect 1.524x1.524 smd: 137(0,0)
Pad_e42345
  rect 1.524x1.524 smd: 138(0,0)
Pad_e42347
  rect 1.524x1.524 smd: 139(0,0)
Pad_e42349
  rect 1.524x1.524 smd: 140(0,0)
Pad_e42351
  rect 1.524x1.524 smd: 141(0,0)
Pad_e42353
  rect 1.524x1.524 smd: 142(0,0)
Pad_e42355
  rect 1.524x1.524 smd: 143(0,0)
Pad_e42357
  rect 1.524x1.524 smd: 144(0,0)
Pad_e42359
  rect 1.524x1.524 smd: 145(0,0)
Pad_e42361
  rect 1.524x1.524 smd: 146(0,0)
Pad_e42363
  rect 1.524x1.524 smd: 147(0,0)
Pad_e42365
  rect 1.524x1.524 smd: 148(0,0)
Pad_e42367
  rect 1.524x1.524 smd: 149(0,0)
Pad_e42369
  rect 1.524x1.524 smd: 150(0,0)
Pad_e42371
  rect 1.524x1.524 smd: 151(0,0)
Pad_e42373
  rect 1.524x1.524 smd: 152(0,0)
Pad_e42375
  rect 1.524x1.524 smd: 153(0,0)
Pad_e42377
  rect 1.524x1.524 smd: 154(0,0)
Pad_e42379
  rect 1.524x1.524 smd: 155(0,0)
Pad_e42381
  rect 1.524x1.524 smd: 156(0,0)
Pad_e42383
  rect 1.524x1.524 smd: 157(0,0)
Pad_e42385
  rect 1.524x1.524 smd: 158(0,0)
Pad_e42387
  rect 1.524x1.524 smd: 159(0,0)
Pad_e42389
  rect 1.524x1.524 smd: 160(0,0)
Pad_e42391
  rect 1.524x1.524 smd: 161(0,0)
Pad_e42393
  rect 1.524x1.524 smd: 162(0,0)
Pad_e42395
  rect 1.524x1.524 smd: 163(0,0)
Pad_e42397
  rect 1.524x1.524 smd: 164(0,0)
Pad_e42399
  rect 1.524x1.524 smd: 165(0,0)
Pad_e42401
  rect 1.524x1.524 smd: 166(0,0)
Pad_e42403
  rect 1.524x1.524 smd: 167(0,0)
Pad_e42405
  rect 1.524x1.524 smd: 168(0,0)
Pad_e42407
  rect 1.524x1.524 smd: 169(0,0)
Pad_e42409
  rect 1.524x1.524 smd: 170(0,0)
Pad_e42411
  rect 1.524x1.524 smd: 171(0,0)
Pad_e42413
  rect 1.524x1.524 smd: 172(0,0)
Pad_e42415
  rect 1.524x1.524 smd: 173(0,0)
Pad_e42417
  rect 1.524x1.524 smd: 174(0,0)
Pad_e42419
  rect 1.524x1.524 smd: 175(0,0)
Pad_e42421
  rect 1.524x1.524 smd: 176(0,0)
Pad_e42423
  rect 1.524x1.524 smd: 177(0,0)
Pad_e42432
  rect 1.524x1.524 smd: 163(0,0)
Pad_e42433
  rect 1.524x1.524 smd: 171(0,0)
Pad_e42434
  rect 1.524x1.524 smd: 162(0,0)
Pad_e42435
  rect 1.524x1.524 smd: 170(0,0)
Pad_e42436
  rect 1.524x1.524 smd: 172(0,0)
Pad_e42438
  rect 1.524x1.524 smd: 164(0,0)
Pad_e42439
  rect 1.524x1.524 smd: 165(0,0)
Pad_e42528
  rect 1.524x1.524 smd: 2(0,0)
Pad_e42529
  rect 1.524x1.524 smd: 63(0,0)
Pad_e42530
  rect 1.524x1.524 smd: 75(0,0)
Pad_e42531
  rect 1.524x1.524 smd: 83(0,0)
Pad_e42532
  rect 1.524x1.524 smd: 91(0,0)
Pad_e42533
  rect 1.524x1.524 smd: 99(0,0)
Pad_e42534
  rect 1.524x1.524 smd: 107(0,0)
Pad_e42535
  rect 1.524x1.524 smd: 115(0,0)
Pad_e42536
  rect 1.524x1.524 smd: 123(0,0)
Pad_e42537
  rect 1.524x1.524 smd: 131(0,0)
Pad_e42538
  rect 1.524x1.524 smd: 139(0,0)
Pad_e42539
  rect 1.524x1.524 smd: 61(0,0)
Pad_e42540
  rect 1.524x1.524 smd: 54(0,0)
Pad_e42541
  rect 1.524x1.524 smd: 56(0,0)
Pad_e42542
  rect 1.524x1.524 smd: 58(0,0)
Pad_e42543
  rect 1.524x1.524 smd: 59(0,0)
Pad_e42544
  rect 1.524x1.524 smd: 60(0,0)
Pad_e42545
  rect 1.524x1.524 smd: 64(0,0)
Pad_e42546
  rect 1.524x1.524 smd: 65(0,0)
Pad_e42547
  rect 1.524x1.524 smd: 66(0,0)
Pad_e42548
  rect 1.524x1.524 smd: 67(0,0)
Pad_e42549
  rect 1.524x1.524 smd: 72(0,0)
Pad_e42550
  rect 1.524x1.524 smd: 73(0,0)
Pad_e42551
  rect 1.524x1.524 smd: 76(0,0)
Pad_e42552
  rect 1.524x1.524 smd: 77(0,0)
Pad_e42553
  rect 1.524x1.524 smd: 78(0,0)
Pad_e42554
  rect 1.524x1.524 smd: 79(0,0)
Pad_e42555
  rect 1.524x1.524 smd: 80(0,0)
Pad_e42556
  rect 1.524x1.524 smd: 81(0,0)
Pad_e42557
  rect 1.524x1.524 smd: 84(0,0)
Pad_e42558
  rect 1.524x1.524 smd: 85(0,0)
Pad_e42559
  rect 1.524x1.524 smd: 86(0,0)
Pad_e42560
  rect 1.524x1.524 smd: 87(0,0)
Pad_e42561
  rect 1.524x1.524 smd: 88(0,0)
Pad_e42562
  rect 1.524x1.524 smd: 89(0,0)
Pad_e42563
  rect 1.524x1.524 smd: 94(0,0)
Pad_e42564
  rect 1.524x1.524 smd: 95(0,0)
Pad_e42565
  rect 1.524x1.524 smd: 96(0,0)
Pad_e42566
  rect 1.524x1.524 smd: 97(0,0)
Pad_e42567
  rect 1.524x1.524 smd: 104(0,0)
Pad_e42568
  rect 1.524x1.524 smd: 105(0,0)
Pad_e42569
  rect 1.524x1.524 smd: 113(0,0)
Pad_e42570
  rect 1.524x1.524 smd: 132(0,0)
Pad_e42571
  rect 1.524x1.524 smd: 133(0,0)
Pad_e42572
  rect 1.524x1.524 smd: 134(0,0)
Pad_e42573
  rect 1.524x1.524 smd: 135(0,0)
Pad_e42574
  rect 1.524x1.524 smd: 136(0,0)
Pad_e42575
  rect 1.524x1.524 smd: 137(0,0)
Pad_e42576
  rect 1.524x1.524 smd: 140(0,0)
Pad_e42577
  rect 1.524x1.524 smd: 141(0,0)
Pad_e42578
  rect 1.524x1.524 smd: 142(0,0)
Pad_e42579
  rect 1.524x1.524 smd: 143(0,0)
Pad_e42580
  rect 1.524x1.524 smd: 144(0,0)
Pad_e42581
  rect 1.524x1.524 smd: 145(0,0)
Pad_e42582
  rect 1.524x1.524 smd: 1(0,0)
Pad_e42583
  rect 1.524x1.524 smd: 62(0,0)
Pad_e42584
  rect 1.524x1.524 smd: 74(0,0)
Pad_e42585
  rect 1.524x1.524 smd: 82(0,0)
Pad_e42586
  rect 1.524x1.524 smd: 90(0,0)
Pad_e42587
  rect 1.524x1.524 smd: 98(0,0)
Pad_e42588
  rect 1.524x1.524 smd: 106(0,0)
Pad_e42589
  rect 1.524x1.524 smd: 114(0,0)
Pad_e42590
  rect 1.524x1.524 smd: 122(0,0)
Pad_e42591
  rect 1.524x1.524 smd: 130(0,0)
Pad_e42592
  rect 1.524x1.524 smd: 138(0,0)
Pad_e42593
  rect 1.524x1.524 smd: 92(0,0)
Pad_e42594
  rect 1.524x1.524 smd: 93(0,0)
Pad_e42595
  rect 1.524x1.524 smd: 100(0,0)
Pad_e42596
  rect 1.524x1.524 smd: 101(0,0)
Pad_e42597
  rect 1.524x1.524 smd: 102(0,0)
Pad_e42598
  rect 1.524x1.524 smd: 103(0,0)
Pad_e42599
  rect 1.524x1.524 smd: 108(0,0)
Pad_e42600
  rect 1.524x1.524 smd: 109(0,0)
Pad_e42601
  rect 1.524x1.524 smd: 110(0,0)
Pad_e42602
  rect 1.524x1.524 smd: 111(0,0)
Pad_e42603
  rect 1.524x1.524 smd: 112(0,0)
Pad_e42604
  rect 1.524x1.524 smd: 116(0,0)
Pad_e42605
  rect 1.524x1.524 smd: 117(0,0)
Pad_e42606
  rect 1.524x1.524 smd: 118(0,0)
Pad_e42607
  rect 1.524x1.524 smd: 119(0,0)
Pad_e42608
  rect 1.524x1.524 smd: 120(0,0)
Pad_e42609
  rect 1.524x1.524 smd: 121(0,0)
Pad_e42610
  rect 1.524x1.524 smd: 124(0,0)
Pad_e42611
  rect 1.524x1.524 smd: 125(0,0)
Pad_e42612
  rect 1.524x1.524 smd: 126(0,0)
Pad_e42613
  rect 1.524x1.524 smd: 127(0,0)
Pad_e42614
  rect 1.524x1.524 smd: 128(0,0)
Pad_e42615
  rect 1.524x1.524 smd: 129(0,0)
Pad_e42648
  rect 1.524x1.524 smd: 115(0,0)
Pad_e42649
  rect 1.524x1.524 smd: 123(0,0)
Pad_e42650
  rect 1.524x1.524 smd: 131(0,0)
Pad_e42651
  rect 1.524x1.524 smd: 139(0,0)
Pad_e42652
  rect 1.524x1.524 smd: 132(0,0)
Pad_e42653
  rect 1.524x1.524 smd: 133(0,0)
Pad_e42654
  rect 1.524x1.524 smd: 134(0,0)
Pad_e42655
  rect 1.524x1.524 smd: 135(0,0)
Pad_e42656
  rect 1.524x1.524 smd: 136(0,0)
Pad_e42657
  rect 1.524x1.524 smd: 137(0,0)
Pad_e42658
  rect 1.524x1.524 smd: 140(0,0)
Pad_e42659
  rect 1.524x1.524 smd: 141(0,0)
Pad_e42660
  rect 1.524x1.524 smd: 142(0,0)
Pad_e42661
  rect 1.524x1.524 smd: 143(0,0)
Pad_e42662
  rect 1.524x1.524 smd: 144(0,0)
Pad_e42663
  rect 1.524x1.524 smd: 145(0,0)
Pad_e42664
  rect 1.524x1.524 smd: 116(0,0)
Pad_e42665
  rect 1.524x1.524 smd: 117(0,0)
Pad_e42666
  rect 1.524x1.524 smd: 118(0,0)
Pad_e42667
  rect 1.524x1.524 smd: 119(0,0)
Pad_e42668
  rect 1.524x1.524 smd: 120(0,0)
Pad_e42669
  rect 1.524x1.524 smd: 121(0,0)
Pad_e42670
  rect 1.524x1.524 smd: 124(0,0)
Pad_e42671
  rect 1.524x1.524 smd: 125(0,0)
Pad_e42672
  rect 1.524x1.524 smd: 126(0,0)
Pad_e42673
  rect 1.524x1.524 smd: 127(0,0)
Pad_e42674
  rect 1.524x1.524 smd: 128(0,0)
Pad_e42675
  rect 1.524x1.524 smd: 129(0,0)
Pad_e42676
  rect 1.524x1.524 smd: 114(0,0)
Pad_e42677
  rect 1.524x1.524 smd: 122(0,0)
Pad_e42678
  rect 1.524x1.524 smd: 130(0,0)
Pad_e42679
  rect 1.524x1.524 smd: 138(0,0)
Pad_e42700
  rect 1.524x1.524 smd: 2(0,0)
Pad_e42701
  rect 1.524x1.524 smd: 54(0,0)
Pad_e42702
  rect 1.524x1.524 smd: 1(0,0)
Pad_e42705
  rect 1.524x1.524 smd: 2(0,0)
Pad_e42706
  rect 1.524x1.524 smd: 1(0,0)
R0603
  rect 0.806x0.864 smd: 1(-0.753,0) 2(0.753,0)
RESC1608X50N
  rect 0.94x1.02 smd: 1(-0.79,0) 2(0.79,0)
RESC2012X50N
  rect 1.05x1.45 smd: 1(-0.95,0) 2(0.95,0)
RESCAXS80P320X150X55-8N
  rect 0.7x0.64 smd: 1(-0.7,1.27) 4(-0.7,-1.27) 5(0.7,-1.27) 8(0.7,1.27)
  rect 0.7x0.5 smd: 2(-0.7,0.4) 3(-0.7,-0.4) 6(0.7,-0.4) 7(0.7,0.4)
SOIC127P599X175-8N
  rrect 1.97x0.6 smd: 1(-2.47,1.905) 2(-2.47,0.635) 3(-2.47,-0.635) 4(-2.47,-1.905) 5(2.47,-1.905) 6(2.47,-0.635) 7(2.47,0.635) 8(2.47,1.905)
SOIC127P600X175-8N
  rect 1.528x0.65 smd: 1(-2.711,1.905) 2(-2.711,0.635) 3(-2.711,-0.635) 4(-2.711,-1.905) 5(2.711,-1.905) 6(2.711,-0.635) 7(2.711,0.635) 8(2.711,1.905)
SOIC127P1030X265-16N
  rrect 2.03x0.6 smd: 1(-4.64,4.445) 2(-4.64,3.175) 3(-4.64,1.905) 4(-4.64,0.635) 5(-4.64,-0.635) 6(-4.64,-1.905) 7(-4.64,-3.175) 8(-4.64,-4.445) 9(4.64,-4.445) 10(4.64,-3.175) 11(4.64,-1.905) 12(4.64,-0.635) 13(4.64,0.635) 14(4.64,1.905) 15(4.64,3.175) 16(4.64,4.445)
SOP65P640X120-24N
  rrect 1.49x0.41 smd: 1(-2.87,3.575) 2(-2.87,2.925) 3(-2.87,2.275) 4(-2.87,1.625) 5(-2.87,0.975) 6(-2.87,0.325) 7(-2.87,-0.325) 8(-2.87,-0.975) 9(-2.87,-1.625) 10(-2.87,-2.275) 11(-2.87,-2.925) 12(-2.87,-3.575) 13(2.87,-3.575) 14(2.87,-2.925) 15(2.87,-2.275) 16(2.87,-1.625) 17(2.87,-0.975) 18(2.87,-0.325) 19(2.87,0.325) 20(2.87,0.975) 21(2.87,1.625) 22(2.87,2.275) 23(2.87,2.925) 24(2.87,3.575)
SOT192P237X122-4N
  rrect 1.24x0.99 smd: 1(-1.055,0.76)
  rrect 1.24x0.59 smd: 2(-1.055,-0.96) 3(1.055,-0.96) 4(1.055,0.96)
TEENSY41
  round 1.665 hole 1.11: 1(0,0) 2(2.54,0) 3(5.08,0) 4(7.62,0) 5(10.16,0) 6(12.7,0) 7(15.24,0) 8(17.78,0) 9(20.32,0) 10(22.86,0) 11(25.4,0) 12(27.94,0) 13(27.94,15.24) 14(25.4,15.24) 15(22.86,15.24) 16(20.32,15.24) 17(17.78,15.24) 18(15.24,15.24) 19(12.7,15.24) 20(10.16,15.24) 21(7.62,15.24) 22(5.08,15.24) 23(2.54,15.24) 24(33.02,0) 25(35.56,0) 26(38.1,0) 27(40.64,0) 28(43.18,0) 29(45.72,0) 30(48.26,0) 31(50.8,0) 32(53.34,0) 33(53.34,15.24) 34(50.8,15.24) 35(48.26,15.24) 36(45.72,15.24) 37(43.18,15.24) 38(40.64,15.24) 39(38.1,15.24) 40(35.56,15.24) 41(33.02,15.24) 42(30.48,0) 43(40.64,2.54) 44(40.64,5.08) 45(40.64,7.62) 46(40.64,10.16) 47(40.64,12.7) 48(11.43,3.05) 49(8.89,3.05) 50(6.35,3.05) 51(3.81,3.05) 52(1.27,3.05) 53(0,15.24) 55(-5.08,15.24) 57(-2.54,0) 68(-2.54,12.7) 69(30.48,15.24) 70(-2.54,15.24) 71(-5.08,0)
WE-SHC_SMD-FRAME_36103205S
  rect 2.6x1 smd: 1(-3.75,10.25) 2(3.75,10.25) 7(-3.75,-10.25) 8(3.75,-10.25)
  rect 1x2.6 smd: 3(-10.25,3.75) 4(-10.25,-3.75) 5(10.25,-3.75) 6(10.25,3.75)
  rect 3.3x1 smd: 9(-9.1,10.25) 11(9.1,10.25) 13(-9.1,-10.25) 15(9.1,-10.25)
  rect 1x3.3 smd: 10(-10.25,9.1) 12(10.25,9.1) 14(-10.25,-9.1) 16(10.25,-9.1)

## Nets
As in the schematic, except:
AGND: C1.2 C4.2 C5.1 C6.1 C7.1 C8.1 C9.2 C10.2 C11.2 NOREF.132 NOREF#2.115 NOREF#3.96 NOREF#4.127 NOREF#5.2 NOREF#6.171 NOREF#7.84 NOREF#8.99 NOREF#9.153 NOREF#10.123 NOREF#11.145 NOREF#12.72 NOREF#13.64 NOREF#14.122 NOREF#15.143 NOREF#16.87 NOREF#17.145 NOREF#18.163 NOREF#19.104 NOREF#20.144 NOREF#21.97 NOREF#22.173 NOREF#23.136 NOREF#24.174 NOREF#25.93 NOREF#26.74 NOREF#27.126 NOREF#28.139 NOREF#29.148 NOREF#30.149 NOREF#31.150 NOREF#32.62 NOREF#33.131 NOREF#34.141 NOREF#35.134 NOREF#36.135 NOREF#37.115 NOREF#38.121 NOREF#39.58 NOREF#40.63 NOREF#41.118 NOREF#42.101 NOREF#43.112 NOREF#44.151 NOREF#45.175 NOREF#46.81 NOREF#47.142 NOREF#48.87 NOREF#49.60 NOREF#50.129 NOREF#51.121 NOREF#52.113 NOREF#53.159 NOREF#54.125 NOREF#55.94 NOREF#56.124 NOREF#57.144 NOREF#58.122 NOREF#59.132 NOREF#60.128 NOREF#61.119 NOREF#62.164 NOREF#63.88 NOREF#64.54 NOREF#65.111 NOREF#66.2 NOREF#67.128 NOREF#68.163 NOREF#69.64 NOREF#70.94 NOREF#71.106 NOREF#72.133 NOREF#73.167 NOREF#74.114 NOREF#75.65 NOREF#76.110 NOREF#77.77 NOREF#78.1 NOREF#79.116 NOREF#80.118 NOREF#81.79 NOREF#82.60 NOREF#83.125 NOREF#84.130 NOREF#85.119 NOREF#86.105 NOREF#87.74 NOREF#88.122 NOREF#89.76 NOREF#90.130 NOREF#91.135 NOREF#92.133 NOREF#93.155 NOREF#94.117 NOREF#95.72 NOREF#96.73 NOREF#97.139 NOREF#98.176 NOREF#99.77 NOREF#100.145 NOREF#101.137 NOREF#102.90 NOREF#103.101 NOREF#104.102 NOREF#105.61 NOREF#106.126 NOREF#107.80 NOREF#108.166 NOREF#109.105 NOREF#110.131 NOREF#111.123 NOREF#112.106 NOREF#113.107 NOREF#114.125 NOREF#115.114 NOREF#116.123 NOREF#117.59 NOREF#118.137 NOREF#119.110 NOREF#120.82 NOREF#121.172 NOREF#122.165 NOREF#123.139 NOREF#124.104 NOREF#125.96 NOREF#126.133 NOREF#127.54 NOREF#128.56 NOREF#129.75 NOREF#130.132 NOREF#131.108 NOREF#132.136 NOREF#133.117 NOREF#134.162 NOREF#135.140 NOREF#136.66 NOREF#137.143 NOREF#138.58 NOREF#139.154 NOREF#140.170 NOREF#141.137 NOREF#142.134 NOREF#143.107 NOREF#144.99 NOREF#145.124 NOREF#146.132 NOREF#147.130 NOREF#148.162 NOREF#149.138 NOREF#150.88 NOREF#151.131 NOREF#152.147 NOREF#153.124 NOREF#154.156 NOREF#155.86 NOREF#156.62 NOREF#157.100 NOREF#158.120 NOREF#159.61 NOREF#160.112 NOREF#161.128 NOREF#162.140 NOREF#163.91 NOREF#164.152 NOREF#165.118 NOREF#166.2 NOREF#167.92 NOREF#168.164 NOREF#169.116 NOREF#170.84 NOREF#171.93 NOREF#172.109 NOREF#173.138 NOREF#174.160 NOREF#175.126 NOREF#176.95 NOREF#177.165 NOREF#178.146 NOREF#179.116 NOREF#180.170 NOREF#181.79 NOREF#182.59 NOREF#183.78 NOREF#184.134 NOREF#185.141 NOREF#186.73 NOREF#187.103 NOREF#188.157 NOREF#189.171 NOREF#190.109 NOREF#191.168 NOREF#192.117 NOREF#193.90 NOREF#194.1 NOREF#195.108 NOREF#196.129 NOREF#197.114 NOREF#198.2 NOREF#199.129 NOREF#200.95 NOREF#201.120 NOREF#202.177 NOREF#203.86 NOREF#204.126 NOREF#205.142 NOREF#206.127 NOREF#207.67 NOREF#208.75 NOREF#209.83 NOREF#210.125 NOREF#211.136 NOREF#212.78 NOREF#213.103 NOREF#214.65 NOREF#215.83 NOREF#216.127 NOREF#217.76 NOREF#218.127 NOREF#219.54 NOREF#220.133 NOREF#221.138 NOREF#222.67 NOREF#223.80 NOREF#224.135 NOREF#225.63 NOREF#226.140 NOREF#227.158 NOREF#228.169 NOREF#229.1 NOREF#230.82 NOREF#231.89 NOREF#232.85 NOREF#233.113 NOREF#234.91 NOREF#235.56 NOREF#236.142 NOREF#237.89 NOREF#238.66 NOREF#239.102 NOREF#240.172 NOREF#241.134 NOREF#242.136 NOREF#243.129 NOREF#244.123 NOREF#245.1 NOREF#246.81 NOREF#247.143 NOREF#248.97 NOREF#249.100 NOREF#250.85 NOREF#251.124 NOREF#252.128 NOREF#253.130 NOREF#254.161 NOREF#255.122 NOREF#256.144 NOREF#257.120 NOREF#258.135 NOREF#259.119 NOREF#260.121 NOREF#261.111 NOREF#262.141 NOREF#263.131 NOREF#264.115 NOREF#265.92 NOREF#266.137 NOREF#267.98 NOREF#268.98 R1.2 R3.1 R5.2 U2.3 U2.4 U2.5 U2.8 U3.7 U3.13 U3.19 U4.2 U5.4 U6.4 U8.8 U8.11 U16.2 U18.9 U18.15 U22.2 U23.4 U24.4 U27.2 U31.2 U32.4 U33.4 U36.2

Pads without a net: U3 3 11 14 15 16 17 18 20 21 23; U4 3; U6 1 5 8; U8 1 9; U14 5 6 7 8 9 10 11 12 15 16; U18 7 10; U22 3; U24 1 5 8; U31 3; U33 1 5 8; U40 1 2 3 4 5 6 7 8 9 10 11 12 13 14 15 16; U41 1 2 3 4 5 6 7 8 9 10 11 12 13 14 15 16; U42 1 2 3 4 5 6 7 8 9 10 11 12 13 14 15 16; U43 1 2 3 4 5 6 7 8 9 10 11 12 13 14 15 16; U44 2 3 4 5; U45 2 3 4 5; U46 2 3 4 5; U47 2 3 4 5; U48 2 3 4 5; U49 2 3 4 5; U50 5 6; U51 1 2 3 4 5 6 7 8 9 14 15 16 17 18 19 20 21 22 23 24 25 29 30 31 32 33 34 35 36 37 38 40 41 43 46 47 50 51 53 57 68

## Via types
v1: diameter 0.61, hole 0.305, Top Layer to Bottom Layer, 1760 vias
v2: diameter 0.406, hole 0.305, Top Layer to Bottom Layer, 5 vias
v3: diameter 0.508, hole 0.305, Top Layer to Bottom Layer, 1 via
v4: diameter 5.995, hole 3.2, Top Layer to Bottom Layer, 4 vias

## Routing (per net, layer and track width the routed paths; a pad name or vN(x,y) marks a point on that pad's centre or on a via; arc(x,y) is an arc through that point)
+2.5V: length 20.5
  Top Layer w0.254: C5.2 42.7,37.15 42.7,38.61 42.45,38.86 42.45,40.39 ; 42.07,44.83 U2.7 42.45,43.94 42.45,40.39 ; 42.45,40.39 41.69,39.62 33.73,39.62 U3.12
+3.3V_D: length 12.4
  Inner2 w0.254: U51.42 74.58,38.23 74.58,42.15 v1(72.03,44.7)
  vias: v1(101.88,23.56) v1(103.42,23.59)
+3.3VANALOGSIDE:
  vias: v1(15.1,42.93) v1(26.25,45.85) v1(32.61,44.17) v1(33.18,38.8) v1(39.12,26.82) v1(39.93,70.05) v1(40.74,65.08) v1(42.78,51.04) v1(44.61,48.9) v1(44.86,46.86) v1(47.66,41.21) v1(47.92,49.15) v1(47.9,47.42) v1(49.58,44.36) v1(62.65,44.7) v2(43.02,42.21)
+5V_D:
  vias: v1(71.98,35.31) v1(71.98,32.77)
+5V_ISO: length 2
  Top Layer w0.254: v1(60.74,35.19) 62.58,35.19 v1(62.7,35.31)
  vias: v1(40.17,36.17) v1(41.81,37.78) v1(45.15,36.39) v1(46.83,36.45) v2(43.52,39.32) v2(44.01,39.53)
AGND: length 13.8
  Inner1 w0.254: v1(62.7,32.77) v1(62.7,34.04)
  Bottom Layer w0.254: v1(33.08,43.52) arc(33.32,43.52) 33.56,43.52 33.56,39.99 arc(33.6,39.9) 33.69,39.86 38.05,39.86 arc(38.14,39.9) 38.18,39.99 38.18,43.34 arc(38.25,43.52) 38.43,43.6
  vias: v1(1.88,49.89) v1(1.88,48.36) v1(1.88,46.84) v1(1.88,45.31) v1(1.88,43.79) v1(1.88,42.27) v1(1.88,40.74) v1(1.88,39.22) v1(2.01,38.07) v1(2.01,36.55) v1(2.01,35.03) v1(2.01,33.5) v1(2.01,31.98) v1(2.7,55.22) v1(2.7,53.7) v1(2.7,52.17) v1(3.53,36.55) v1(3.53,35.03) v1(3.53,33.5) v1(3.53,31.98) v1(3.56,30.16) v1(3.56,28.63) v1(4.23,57.76) v1(4.23,55.22) v1(4.23,53.7) v1(4.23,52.17) v1(5.06,36.55) v1(5.06,35.03) v1(5.06,33.5) v1(5.06,31.98) v1(5.08,30.16) v1(5.08,28.63) v1(5.08,27.11) v1(5.08,25.58) v1(5.08,24.06) v1(5.75,62.33) v1(5.75,60.81) v1(5.75,59.28) v1(5.75,57.76) v1(5.75,55.22) v1(5.75,53.7) v1(5.75,52.17) v1(6.58,36.55) v1(6.58,35.03) v1(6.58,33.5) v1(6.61,30.16) v1(6.61,28.63) v1(6.61,27.11) v1(6.61,25.58) v1(6.61,24.06) v1(6.61,22.54) v1(6.61,21.01) v1(7.28,63.86) v1(7.28,62.33) v1(7.28,60.81) v1(7.28,59.28) v1(7.28,57.76) v1(8.13,30.16) v1(8.13,28.63) v1(8.13,27.11) v1(8.13,25.58) v1(8.13,24.06) v1(8.13,22.54) v1(8.13,21.01) v1(8.13,19.49) v1(8.8,66.9) v1(8.8,65.38) v1(8.8,63.86) v1(8.8,62.33) v1(8.8,60.81) v1(8.8,59.28) v1(8.8,57.76) v1(9.66,30.16) v1(9.66,28.63) v1(9.66,27.11) v1(9.66,25.58) v1(9.66,24.06) v1(9.66,22.54) v1(9.66,21.01) v1(9.66,19.49) v1(9.66,17.96) v1(10.32,68.43) v1(10.32,66.9) v1(10.32,65.38) v1(10.32,63.86) v1(10.32,62.33) v1(10.32,60.81) v1(10.32,59.28) v1(10.32,57.76) v1(10.55,51.73) v1(10.55,36.17) v1(11.18,30.16) v1(11.18,28.63) v1(11.18,27.11) v1(11.18,25.58) v1(11.18,24.06) v1(11.18,22.54) v1(11.18,21.01) v1(11.18,19.49) v1(11.18,17.96) v1(11.18,16.44) v1(11.18,14.92) v1(11.33,46.65) v1(11.85,69.95) v1(11.85,68.43) v1(11.85,66.9) v1(11.85,65.38) v1(11.85,63.86) v1(11.85,62.33) v1(11.85,60.81) v1(11.85,59.28) v1(11.85,57.76) v1(12.07,36.17) v1(12.7,30.16) v1(12.7,28.63) v1(12.7,27.11) v1(12.7,25.58) v1(12.7,24.06) v1(12.7,22.54) v1(12.7,21.01) v1(12.7,19.49) v1(12.7,17.96) v1(12.7,16.44) v1(12.7,14.92) v1(12.7,13.39) v1(13.37,71.48) v1(13.37,69.95) v1(13.37,68.43) v1(13.37,66.9) v1(13.37,65.38) v1(13.37,63.86) v1(13.37,62.33) v1(13.37,60.81) v1(13.37,59.28) v1(13.37,57.76) v1(13.59,36.17) v1(14.23,30.16) v1(14.23,28.63) v1(14.23,27.11) v1(14.23,25.58) v1(14.23,24.06) v1(14.23,22.54) v1(14.23,21.01) v1(14.23,19.49) v1(14.23,17.96) v1(14.23,16.44) v1(14.23,14.92) v1(14.23,13.39) v1(14.23,11.87) v1(14.9,73) v1(14.9,71.48) v1(14.9,69.95) v1(14.9,68.43) v1(14.9,66.9) v1(14.9,65.38) v1(14.9,63.86) v1(14.9,62.33) v1(14.9,60.81) v1(14.9,59.28) v1(14.9,57.76) v1(15.12,36.17) v1(15.2,38.23) v1(15.75,30.16) v1(15.75,28.63) v1(15.75,27.11) v1(15.75,25.58) v1(15.75,24.06) v1(15.75,22.54) v1(15.75,21.01) v1(15.75,19.49) v1(15.75,17.96) v1(15.75,16.44) v1(15.75,14.92) v1(15.75,13.39) v1(15.75,11.87) v1(15.75,10.34) v1(16.42,74.52) v1(16.42,73) v1(16.42,71.48) v1(16.42,69.95) v1(16.42,68.43) v1(16.42,66.9) v1(16.42,65.38) v1(16.42,63.86) v1(16.42,62.33) v1(16.42,60.81) v1(16.42,59.28) v1(16.42,57.76) v1(16.64,51.73) v1(16.64,50.21) v1(16.64,36.17) v1(17.28,30.16) v1(17.28,28.63) v1(17.28,27.11) v1(17.28,25.58) v1(17.28,24.06) v1(17.28,22.54) v1(17.28,21.01) v1(17.28,19.49) v1(17.28,17.96) v1(17.28,16.44) v1(17.28,14.92) v1(17.28,13.39) v1(17.28,11.87) v1(17.28,10.34) v1(17.94,76.05) v1(17.94,74.52) v1(17.94,73) v1(17.94,71.48) v1(17.94,69.95) v1(17.94,68.43) v1(17.94,66.9) v1(17.94,65.38) v1(17.94,63.86) v1(17.94,62.33) v1(17.94,60.81) v1(17.94,59.28) v1(17.94,57.76) v1(18.17,51.73) v1(18.17,50.21) v1(18.17,48.68) v1(18.17,40.74) v1(18.17,37.69) v1(18.17,36.17) v1(18.8,30.16) v1(18.8,28.63) v1(18.8,27.11) v1(18.8,25.58) v1(18.8,24.06) v1(18.8,22.54) v1(18.8,21.01) v1(18.8,19.49) v1(18.8,17.96) v1(18.8,16.44) v1(18.8,14.92) v1(18.8,13.39) v1(18.8,11.87) v1(18.8,10.34) v1(18.8,8.82) v1(19.47,76.05) v1(19.47,74.52) v1(19.47,73) v1(19.47,71.48) v1(19.47,69.95) v1(19.47,68.43) v1(19.47,66.9) v1(19.47,65.38) v1(19.47,63.86) v1(19.47,62.33) v1(19.47,60.81) v1(19.47,59.28) v1(19.47,57.76) v1(19.69,51.73) v1(19.69,50.21) v1(19.69,48.68) v1(19.69,39.22) v1(19.69,37.69) v1(19.69,36.17) v1(20.32,30.16) v1(20.32,28.63) v1(20.32,27.11) v1(20.32,25.58) v1(20.32,24.06) v1(20.32,22.54) v1(20.32,21.01) v1(20.32,19.49) v1(20.32,17.96) v1(20.32,16.44) v1(20.32,14.92) v1(20.32,13.39) v1(20.32,11.87) v1(20.32,10.34) v1(20.32,8.82) v1(20.32,7.3) v1(20.99,77.57) v1(20.99,76.05) v1(20.99,74.52) v1(20.99,73) v1(20.99,71.48) v1(20.99,69.95) v1(20.99,68.43) v1(20.99,66.9) v1(20.99,65.38) v1(20.99,63.86) v1(20.99,62.33) v1(20.99,60.81) v1(20.99,59.28) v1(20.99,57.76) v1(21.21,51.73) v1(21.21,50.21) v1(21.21,42.27) v1(21.21,40.74) v1(21.21,39.22) v1(21.21,37.69) v1(21.21,36.17) v1(21.31,43.31) v1(21.85,30.16) v1(21.85,28.63) v1(21.85,27.11) v1(21.85,25.58) v1(21.85,24.06) v1(21.85,22.54) v1(21.85,21.01) v1(21.85,19.49) v1(21.85,17.96) v1(21.85,16.44) v1(21.85,14.92) v1(21.85,13.39) v1(21.85,11.87) v1(21.85,10.34) v1(21.85,8.82) v1(21.85,7.3) v1(22.52,77.57) v1(22.52,76.05) v1(22.52,74.52) v1(22.52,73) v1(22.52,71.48) v1(22.52,69.95) v1(22.52,68.43) v1(22.52,66.9) v1(22.52,65.38) v1(22.52,63.86) v1(22.52,62.33) v1(22.52,60.81) v1(22.52,59.28) v1(22.52,57.76) v1(22.74,40.74) v1(22.74,39.22) v1(22.74,37.69) v1(22.74,36.17) v1(23.37,30.16) v1(23.37,28.63) v1(23.37,27.11) v1(23.37,25.58) v1(23.37,24.06) v1(23.37,22.54) v1(23.37,21.01) v1(23.37,19.49) v1(23.37,17.96) v1(23.37,16.44) v1(23.37,14.92) v1(23.37,13.39) v1(23.37,11.87) v1(23.37,10.34) v1(23.37,8.82) v1(23.37,7.3) v1(23.37,5.77) v1(24.04,79.1) v1(24.04,77.57) v1(24.04,76.05) v1(24.04,74.52) v1(24.04,73) v1(24.04,71.48) v1(24.04,69.95) v1(24.04,68.43) v1(24.04,66.9) v1(24.04,65.38) v1(24.04,63.86) v1(24.04,62.33) v1(24.04,60.81) v1(24.04,59.28) v1(24.04,57.76) v1(24.26,51.73) v1(24.26,40.74) v1(24.26,39.22) v1(24.26,37.69) v1(24.26,36.17) v1(24.9,30.16) v1(24.9,28.63) v1(24.9,27.11) v1(24.9,25.58) v1(24.9,24.06) v1(24.9,22.54) v1(24.9,21.01) v1(24.9,19.49) v1(24.9,17.96) v1(24.9,16.44) v1(24.9,14.92) v1(24.9,13.39) v1(24.9,11.87) v1(24.9,10.34) v1(24.9,8.82) v1(24.9,7.3) v1(24.9,5.77) v1(25.56,79.1) v1(25.56,77.57) v1(25.56,76.05) v1(25.56,74.52) v1(25.56,73) v1(25.56,71.48) v1(25.56,69.95) v1(25.56,68.43) v1(25.56,66.9) v1(25.56,65.38) v1(25.56,63.86) v1(25.56,62.33) v1(25.56,60.81) v1(25.56,59.28) v1(25.56,57.76) v1(25.79,51.73) v1(25.79,42.27) v1(25.79,40.74) v1(25.79,39.22) v1(25.79,37.69) v1(25.79,36.17) v1(26.16,80.75) v1(26.42,30.16) v1(26.42,28.63) v1(26.42,27.11) v1(26.42,25.58) v1(26.42,24.06) v1(26.42,22.54) v1(26.42,21.01) v1(26.42,19.49) v1(26.42,17.96) v1(26.42,16.44) v1(26.42,14.92) v1(26.42,13.39) v1(26.42,11.87) v1(26.42,10.34) v1(26.42,8.82) v1(26.42,7.3) v1(26.42,5.77) v1(26.42,4.25) v1(27.09,80.62) v1(27.09,79.1) v1(27.09,77.57) v1(27.09,76.05) v1(27.09,74.52) v1(27.09,73) v1(27.09,71.48) v1(27.09,69.95) v1(27.09,68.43) v1(27.09,66.9) v1(27.09,65.38) v1(27.09,63.86) v1(27.09,62.33) v1(27.09,60.81) v1(27.09,59.28) v1(27.09,57.76) v1(27.94,28.63) v1(27.94,27.11) v1(27.94,25.58) v1(27.94,24.06) v1(27.94,22.54) v1(27.94,21.01) v1(27.94,19.49) v1(27.94,17.96) v1(27.94,16.44) v1(27.94,14.92) v1(27.94,13.39) v1(27.94,11.87) v1(27.94,10.34) v1(27.94,8.82) v1(27.94,7.3) v1(27.94,5.77) v1(27.94,4.25) v1(29.09,7.36) v1(29.09,5.84) v1(29.09,4.31) v1(29.21,80.75) v1(30.61,7.36) v1(30.61,5.84) v1(30.61,4.31) v1(30.61,2.79) v1(30.73,82.27) v1(30.73,80.75) v1(32.14,7.36) v1(32.14,5.84) v1(32.14,4.31) v1(32.14,2.79) v1(32.26,82.27) v1(32.26,80.75) v1(33.37,3.41) v1(33.37,1.88) v1(33.78,82.27) v1(33.78,80.75) v1(33.91,36.93) v1(33.89,27.66) v1(33.89,26.14) v1(33.89,24.61) v1(33.89,23.09) v1(33.89,21.56) v1(33.89,20.04) v1(33.89,18.52) v1(34.17,74.4) v1(34.17,72.87) v1(34.17,71.35) v1(34.17,66.78) v1(34.17,65.25) v1(34.17,63.73) v1(34.17,62.2) v1(34.17,60.68) v1(34.17,59.16) v1(34.69,51.94) v1(34.69,50.42) v1(34.89,3.41) v1(34.89,1.88) v1(35.3,82.27) v1(35.3,80.75) v1(35.41,27.66) v1(35.41,26.14) v1(35.41,24.61) v1(35.41,23.09) v1(35.41,21.56) v1(35.41,20.04) v1(35.41,18.52) v1(35.44,36.93) v1(35.44,35.41) v1(35.69,74.4) v1(35.69,72.87) v1(35.69,71.35) v1(36.22,51.94) v1(36.22,50.42) v1(36.42,3.41) v1(36.42,1.88) v1(36.96,38.46) v1(36.96,36.93) v1(36.96,35.41) v1(36.93,20.04) v1(37.22,66.78) v1(37.22,65.25) v1(37.22,63.73) v1(37.22,62.2) v1(37.22,60.68) v1(37.22,59.16) v1(37.74,51.94) v1(37.94,3.41) v1(37.94,1.88) v1(38.49,38.46) v1(38.49,36.93) v1(38.49,35.41) v1(39.46,3.41) v1(39.46,1.88) v1(40.01,38.46) v1(40.37,41.67) v1(40.61,84.05) v1(40.64,58.55) v1(40.99,3.41) v1(40.99,1.88) v1(41.38,51.04) v1(41.39,43.16) v1(41.81,36.38) v1(41.94,41.4) v1(42.07,48.9) v1(42.14,84.05) v1(42.46,16.09) v1(42.51,3.41) v1(42.51,1.88) v1(42.92,46.21) v1(42.86,27.66) v1(42.86,26.14) v1(42.86,24.61) v1(42.86,23.09) v1(42.86,21.56) v1(43.29,60.46) v1(43.31,41.08) v1(43.34,48.9) v1(43.46,37.78) v1(43.66,84.05) v1(44.04,3.41) v1(44.04,1.88) v1(44.39,27.66) v1(44.39,26.14) v1(44.39,24.61) v1(44.39,23.09) v1(44.39,21.56) v1(44.84,68.3) v1(45.18,84.05) v1(45.15,37.79) v1(45.35,73.86) v1(45.56,3.41) v1(45.56,1.88) v1(45.91,27.66) v1(45.91,26.14) v1(45.91,24.61) v1(45.91,23.09) v1(45.91,21.56) v1(46.11,35.41) v1(46.36,68.3) v1(46.36,66.78) v1(46.36,59.16) v1(46.71,84.05) v1(46.83,37.85) v1(47.12,3.48) v1(47.12,1.95) v1(47.43,27.66) v1(47.43,26.14) v1(47.43,24.61) v1(47.43,23.09) v1(47.43,21.56) v1(47.43,20.04) v1(47.63,35.41) v1(47.66,39.81) v1(47.88,68.3) v1(47.88,66.78) v1(47.88,65.25) v1(47.88,63.73) v1(47.88,62.2) v1(47.88,60.68) v1(47.88,59.16) v1(47.91,44.29) v1(48.23,84.05) v1(48.65,6.52) v1(48.65,5) v1(48.65,3.48) v1(48.65,1.95) v1(48.96,27.66) v1(48.96,26.14) v1(48.96,24.61) v1(48.96,23.09) v1(48.96,21.56) v1(48.96,20.04) v1(48.96,18.52) v1(48.96,16.99) v1(48.96,15.47) v1(48.96,13.94) v1(48.96,12.42) v1(49.15,43.03) v1(49.15,41.5) v1(49.15,39.98) v1(49.15,38.46) v1(49.15,36.93) v1(49.15,35.41) v1(49.41,74.4) v1(49.41,68.3) v1(49.41,66.78) v1(49.41,65.25) v1(49.41,63.73) v1(49.41,62.2) v1(49.41,60.68) v1(49.41,59.16) v1(49.47,49.15) v1(49.58,45.76) v1(49.76,84.05) v1(50.17,6.52) v1(50.17,5) v1(50.17,3.48) v1(50.17,1.95) v1(50.48,27.66) v1(50.48,26.14) v1(50.48,24.61) v1(50.48,23.09) v1(50.48,21.56) v1(50.48,20.04) v1(50.48,18.52) v1(50.48,16.99) v1(50.48,15.47) v1(50.48,13.94) v1(50.48,12.42) v1(50.68,43.03) v1(50.68,41.5) v1(50.68,39.98) v1(50.68,38.46) v1(50.68,36.93) v1(50.68,35.41) v1(50.81,83.41) v1(50.81,81.89) v1(50.81,80.37) v1(51.28,84.05) v1(51.69,6.52) v1(51.69,5) v1(51.69,3.48) v1(51.69,1.95) v1(52.33,83.41) v1(52.33,81.89) v1(52.33,80.37) v1(53.22,6.52) v1(53.22,5) v1(53.22,3.48) v1(53.22,1.95) v1(55.4,83.19) v1(55.4,81.41) v1(55.4,79.63) v1(55.4,77.85) v1(55.4,76.07) v1(55.4,74.3) v1(55.4,72.52) v1(55.4,70.74) v1(55.4,68.96) v1(55.4,67.18) v1(55.4,65.41) v1(55.4,63.63) v1(55.4,61.85) v1(55.4,60.07) v1(55.4,58.29) v1(55.4,56.48) v1(55.4,54.71) v1(55.78,34.29) v1(55.78,32.51) v1(55.78,30.73) v1(55.78,28.96) v1(55.78,27.18) v1(55.78,25.4) v1(55.78,23.62) v1(55.78,21.84) v1(55.78,20.07) v1(55.78,18.29) v1(55.78,16.51) v1(55.78,14.73) v1(55.78,12.95) v1(55.78,11.18) v1(55.78,9.4) v1(55.78,7.62) v1(55.78,5.84) v1(55.78,4.05) v1(55.78,2.27) v1(57.18,83.19) v1(57.18,81.41) v1(57.18,79.63) v1(57.18,77.85) v1(57.18,76.07) v1(57.18,74.3) v1(57.18,72.52) v1(57.18,70.74) v1(57.18,68.96) v1(57.18,67.18) v1(57.18,65.41) v1(57.18,63.63) v1(57.18,61.85) v1(57.18,60.07) v1(57.18,58.29) v1(57.18,56.48) v1(57.18,54.71) v1(57.56,34.29) v1(57.56,32.51) v1(57.56,30.73) v1(57.56,28.96) v1(57.56,27.18) v1(57.56,25.4) v1(57.56,23.62) v1(57.56,21.84) v1(57.56,20.07) v1(57.56,18.29) v1(57.56,16.51) v1(57.56,14.73) v1(57.56,12.95) v1(57.56,11.18) v1(57.56,9.4) v1(57.56,7.62) v1(57.56,5.84) v1(57.56,4.05) v1(57.56,2.27) v1(58.96,83.19) v1(58.96,81.41) v1(58.96,79.63) v1(58.96,77.85) v1(58.96,76.07) v1(58.96,74.3) v1(58.96,72.52) v1(58.96,70.74) v1(58.96,68.96) v1(58.96,67.18) v1(58.96,65.41) v1(58.96,63.63) v1(58.96,61.85) v1(58.96,60.07) v1(58.96,58.29) v1(58.96,56.48) v1(58.96,54.71) v1(59.34,32.51) v1(59.34,30.73) v1(59.34,28.96) v1(59.34,27.18) v1(59.34,25.4) v1(59.34,23.62) v1(59.34,21.84) v1(59.34,20.07) v1(59.34,18.29) v1(59.34,16.51) v1(59.34,14.73) v1(59.34,12.95) v1(59.34,11.18) v1(59.34,9.4) v1(59.34,7.62) v1(59.34,5.84) v1(59.34,4.05) v1(59.34,2.27) v1(60.74,83.19) v1(60.74,81.41) v1(60.74,79.63) v1(60.74,77.85) v1(60.74,76.07) v1(60.74,74.3) v1(60.74,72.52) v1(60.74,70.74) v1(60.74,68.96) v1(60.74,67.18) v1(60.74,65.41) v1(60.74,63.63) v1(60.74,61.85) v1(60.74,60.07) v1(60.74,58.29) v1(60.74,56.48) v1(61.12,30.73) v1(61.12,28.96) v1(61.12,27.18) v1(61.12,25.4) v1(61.12,23.62) v1(61.12,21.84) v1(61.12,20.07) v1(61.12,18.29) v1(61.12,16.51) v1(61.12,14.73) v1(61.12,12.95) v1(61.12,11.18) v1(61.12,9.4) v1(61.12,7.62) v1(61.12,5.84) v1(61.12,4.05) v1(61.12,2.27) v1(62.51,83.19) v1(62.51,81.41) v1(62.51,79.63) v1(62.51,77.85) v1(62.51,76.07) v1(62.51,74.3) v1(62.51,72.52) v1(62.51,70.74) v1(62.51,68.96) v1(62.51,67.18) v1(62.51,65.41) v1(62.51,63.63) v1(62.51,61.85) v1(62.51,60.07) v1(62.51,58.29) v1(62.65,53.59) v1(62.65,45.97) v1(62.7,41.66) v1(62.9,30.73) v1(62.9,28.96) v1(62.9,27.18) v1(62.9,25.4) v1(62.9,23.62) v1(62.9,21.84) v1(62.9,20.07) v1(62.9,18.29) v1(62.9,16.51) v1(62.9,14.73) v1(62.9,12.95) v1(62.9,11.18) v1(62.9,9.4) v1(62.9,7.62) v1(62.9,5.84) v1(62.9,4.05) v1(62.9,2.27) v1(64.29,83.19) v1(64.29,81.41) v1(64.29,79.63) v1(64.29,77.85) v1(64.29,76.07) v1(64.29,74.3) v1(64.29,72.52) v1(64.29,70.74) v1(64.29,68.96) v1(64.29,67.18) v1(64.29,65.41) v1(64.29,63.63) v1(64.29,61.85) v1(64.29,60.07) v1(64.29,58.29) v1(64.67,30.73) v1(64.67,28.96) v1(64.67,27.18) v1(64.67,25.4) v1(64.67,23.62) v1(64.67,21.84) v1(64.67,20.07) v1(64.67,18.29) v1(64.67,16.51) v1(64.67,14.73) v1(64.67,12.95) v1(64.67,11.18) v1(64.67,9.4) v1(64.67,7.62) v1(64.67,5.84) v1(64.67,4.05) v1(64.67,2.27) v1(66.07,83.19) v1(66.07,81.41) v1(66.07,79.63) v1(66.07,77.85) v1(66.07,76.07) v1(66.07,74.3) v1(66.07,72.52) v1(66.07,70.74) v1(66.07,68.96) v1(66.07,67.18) v1(66.07,65.41) v1(66.07,63.63) v1(66.07,61.85) v1(66.07,60.07) v1(66.07,58.29) v1(66.45,30.73) v1(66.45,28.96) v1(66.45,27.18) v1(66.45,25.4) v1(66.45,23.62) v1(66.45,21.84) v1(66.45,20.07) v1(66.45,18.29) v1(66.45,16.51) v1(66.45,14.73) v1(66.45,12.95) v1(66.45,11.18) v1(66.45,9.4) v1(66.45,7.62) v1(66.45,5.84) v1(66.45,4.05) v1(66.45,2.27) v1(67.85,83.19) v1(67.85,81.41) v1(67.85,79.63) v1(67.85,77.85) v1(67.85,76.07) v1(67.85,74.3) v1(67.85,72.52) v1(67.85,70.74) v1(67.85,68.96) v1(67.85,67.18) v1(67.85,65.41) v1(67.85,63.63) v1(67.85,61.85) v1(67.85,60.07) v1(67.85,58.29) v1(68.23,30.73) v1(68.23,28.96) v1(68.23,27.18) v1(68.23,25.4) v1(68.23,23.62) v1(68.23,21.84) v1(68.23,20.07) v1(68.23,18.29) v1(68.23,16.51) v1(68.23,14.73) v1(68.23,12.95) v1(68.23,11.18) v1(68.23,9.4) v1(68.23,7.62) v1(68.23,5.84) v1(68.23,4.05) v1(68.23,2.27) v2(38.82,40.27) v2(44.02,42.21) v3(33.08,40.92)
